# EAGLE schematic N_5412K (EAGLE 9.5.0)

## Sheet 1 of 2
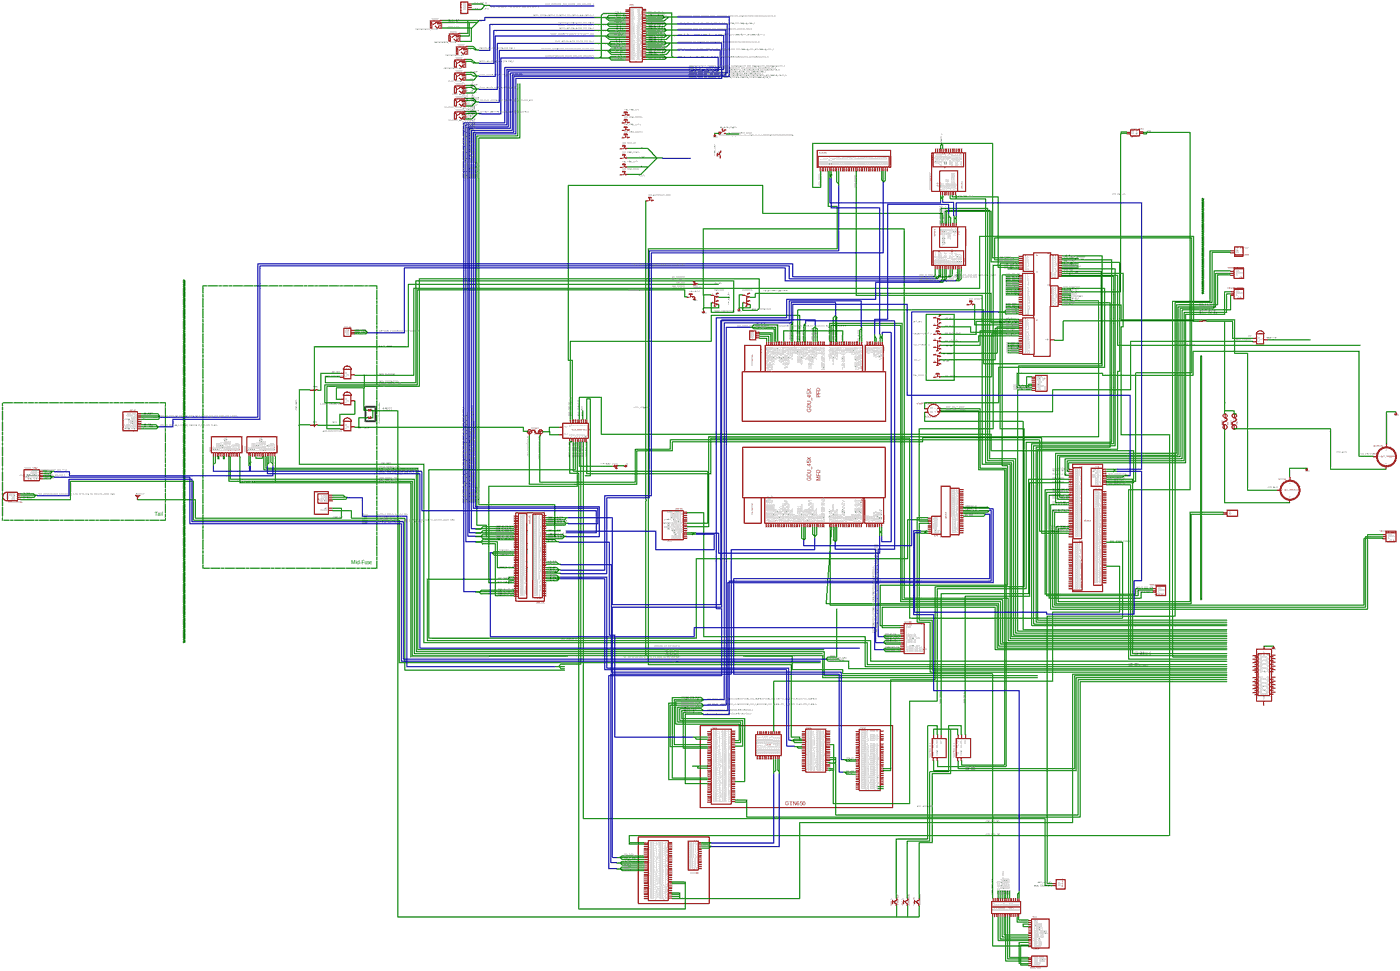
[diagram p0: schematic, sheet 1, overview]
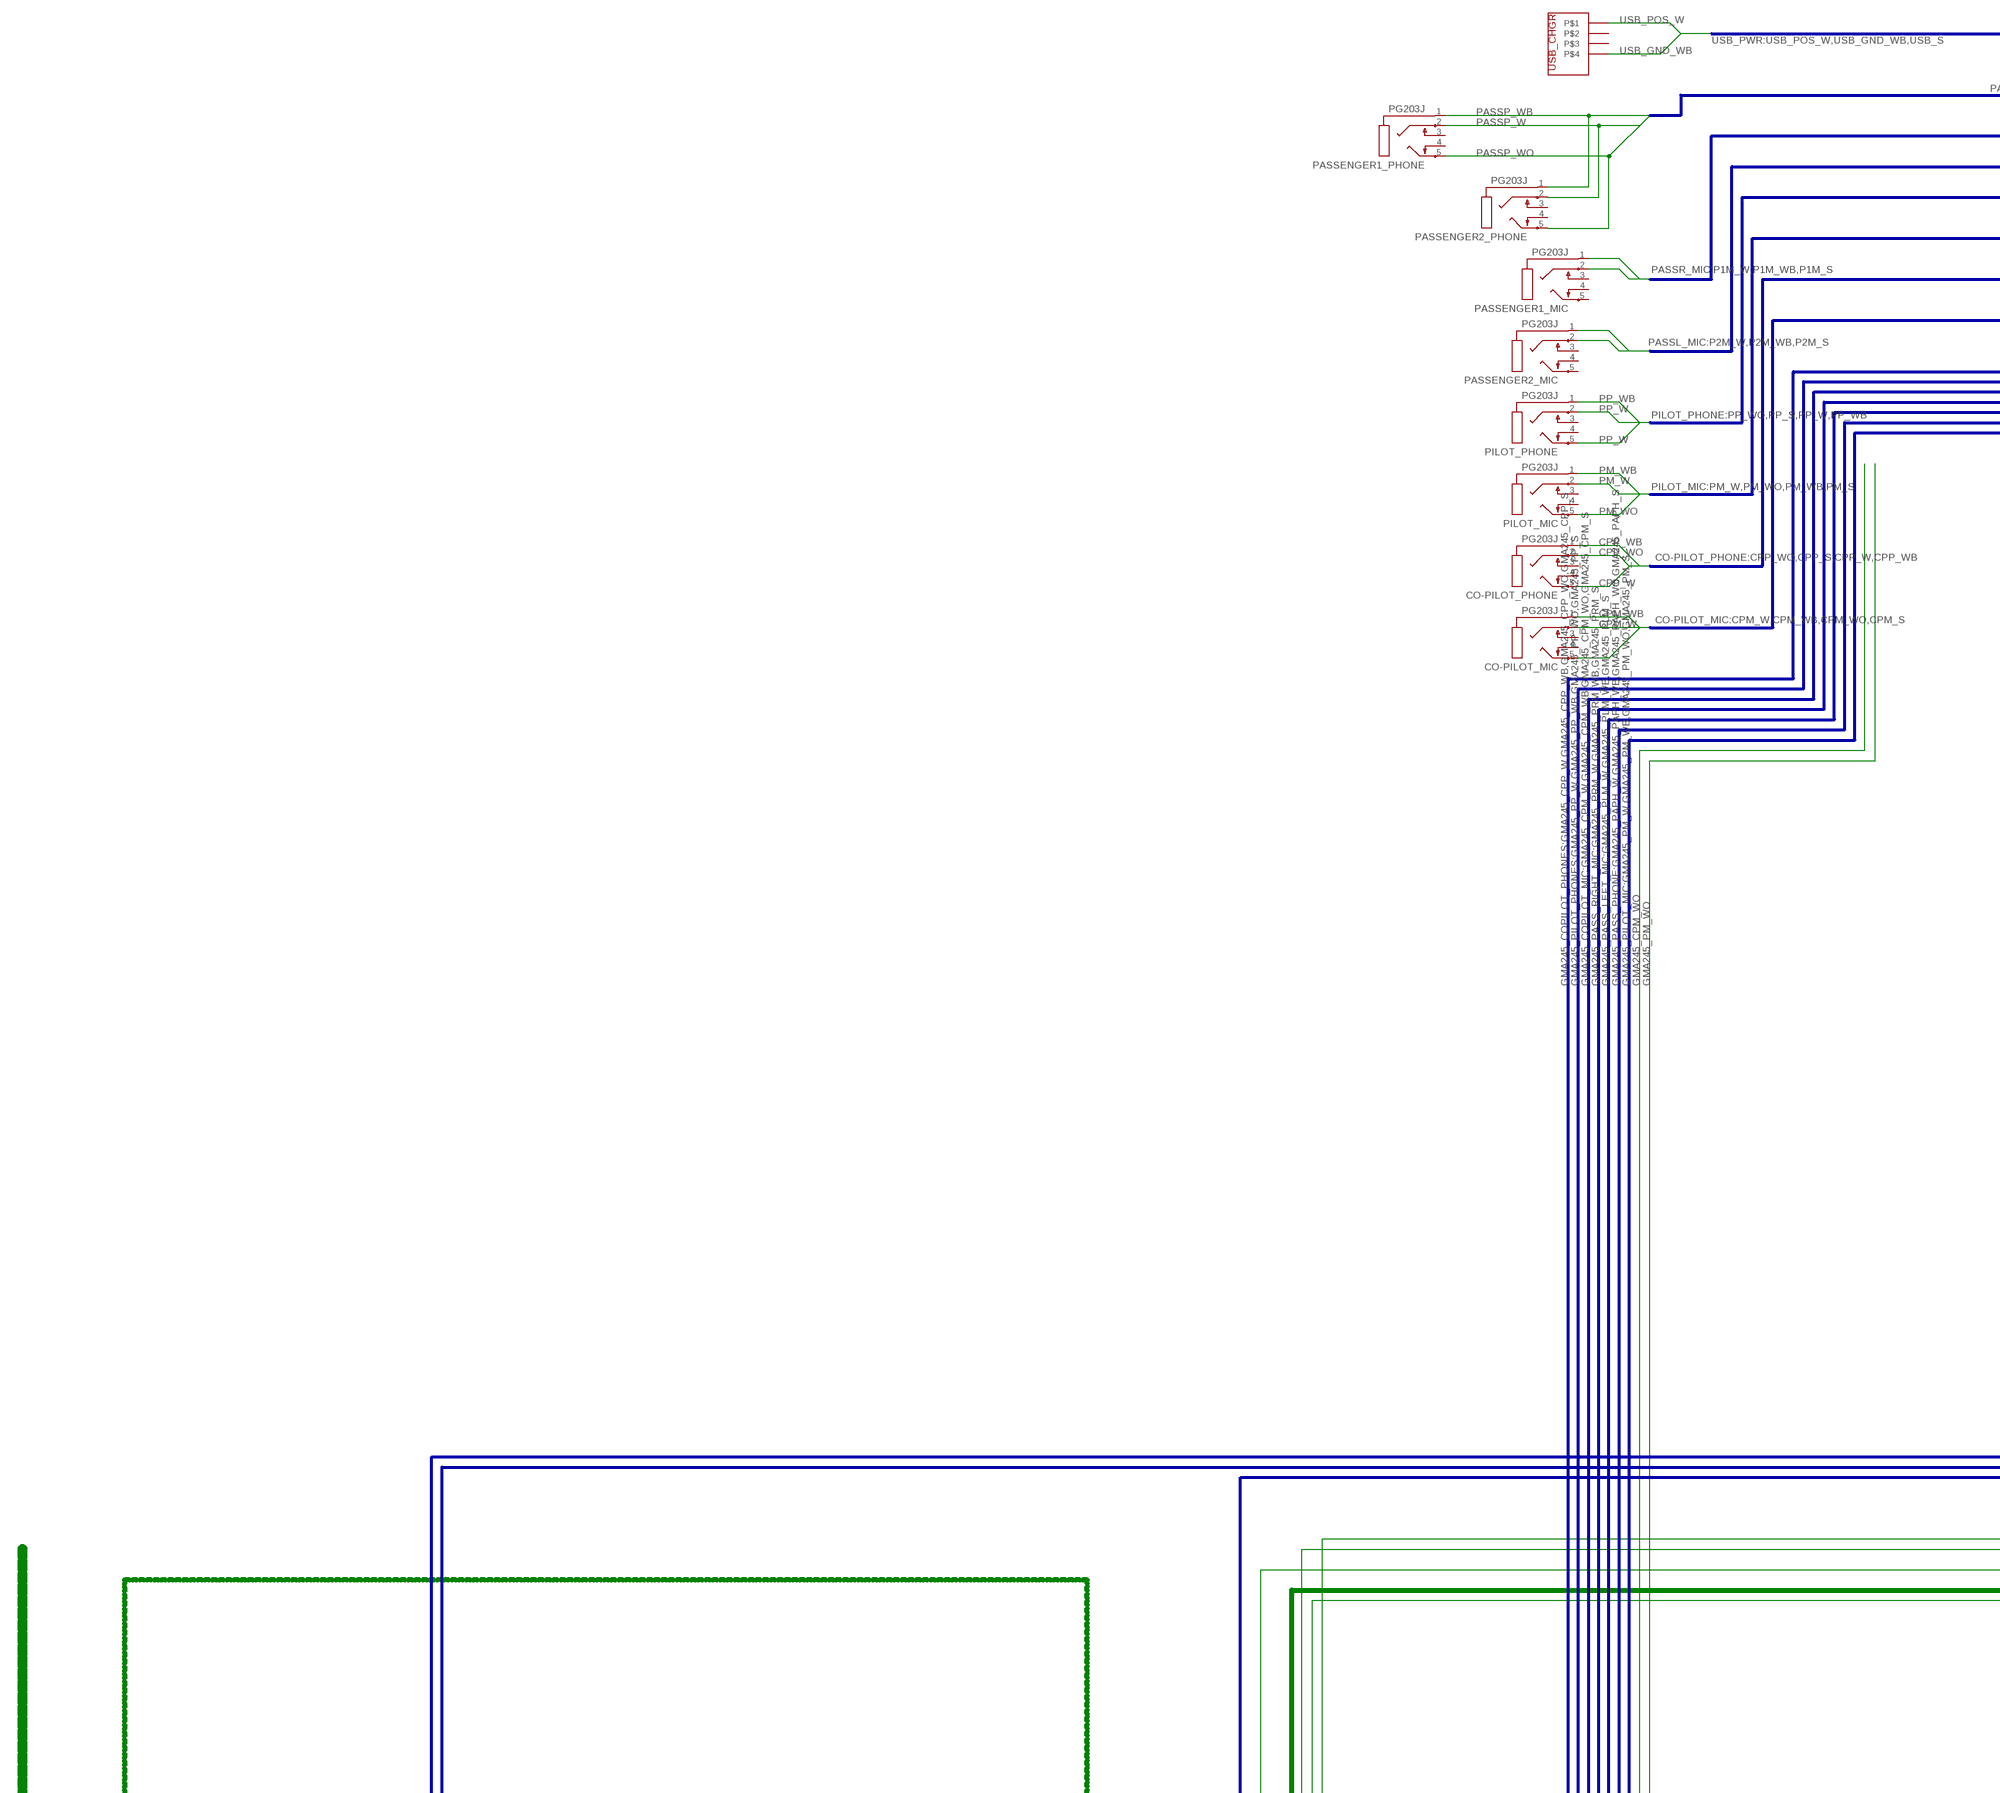
[diagram p1: schematic, sheet 1, part 1 of 9]
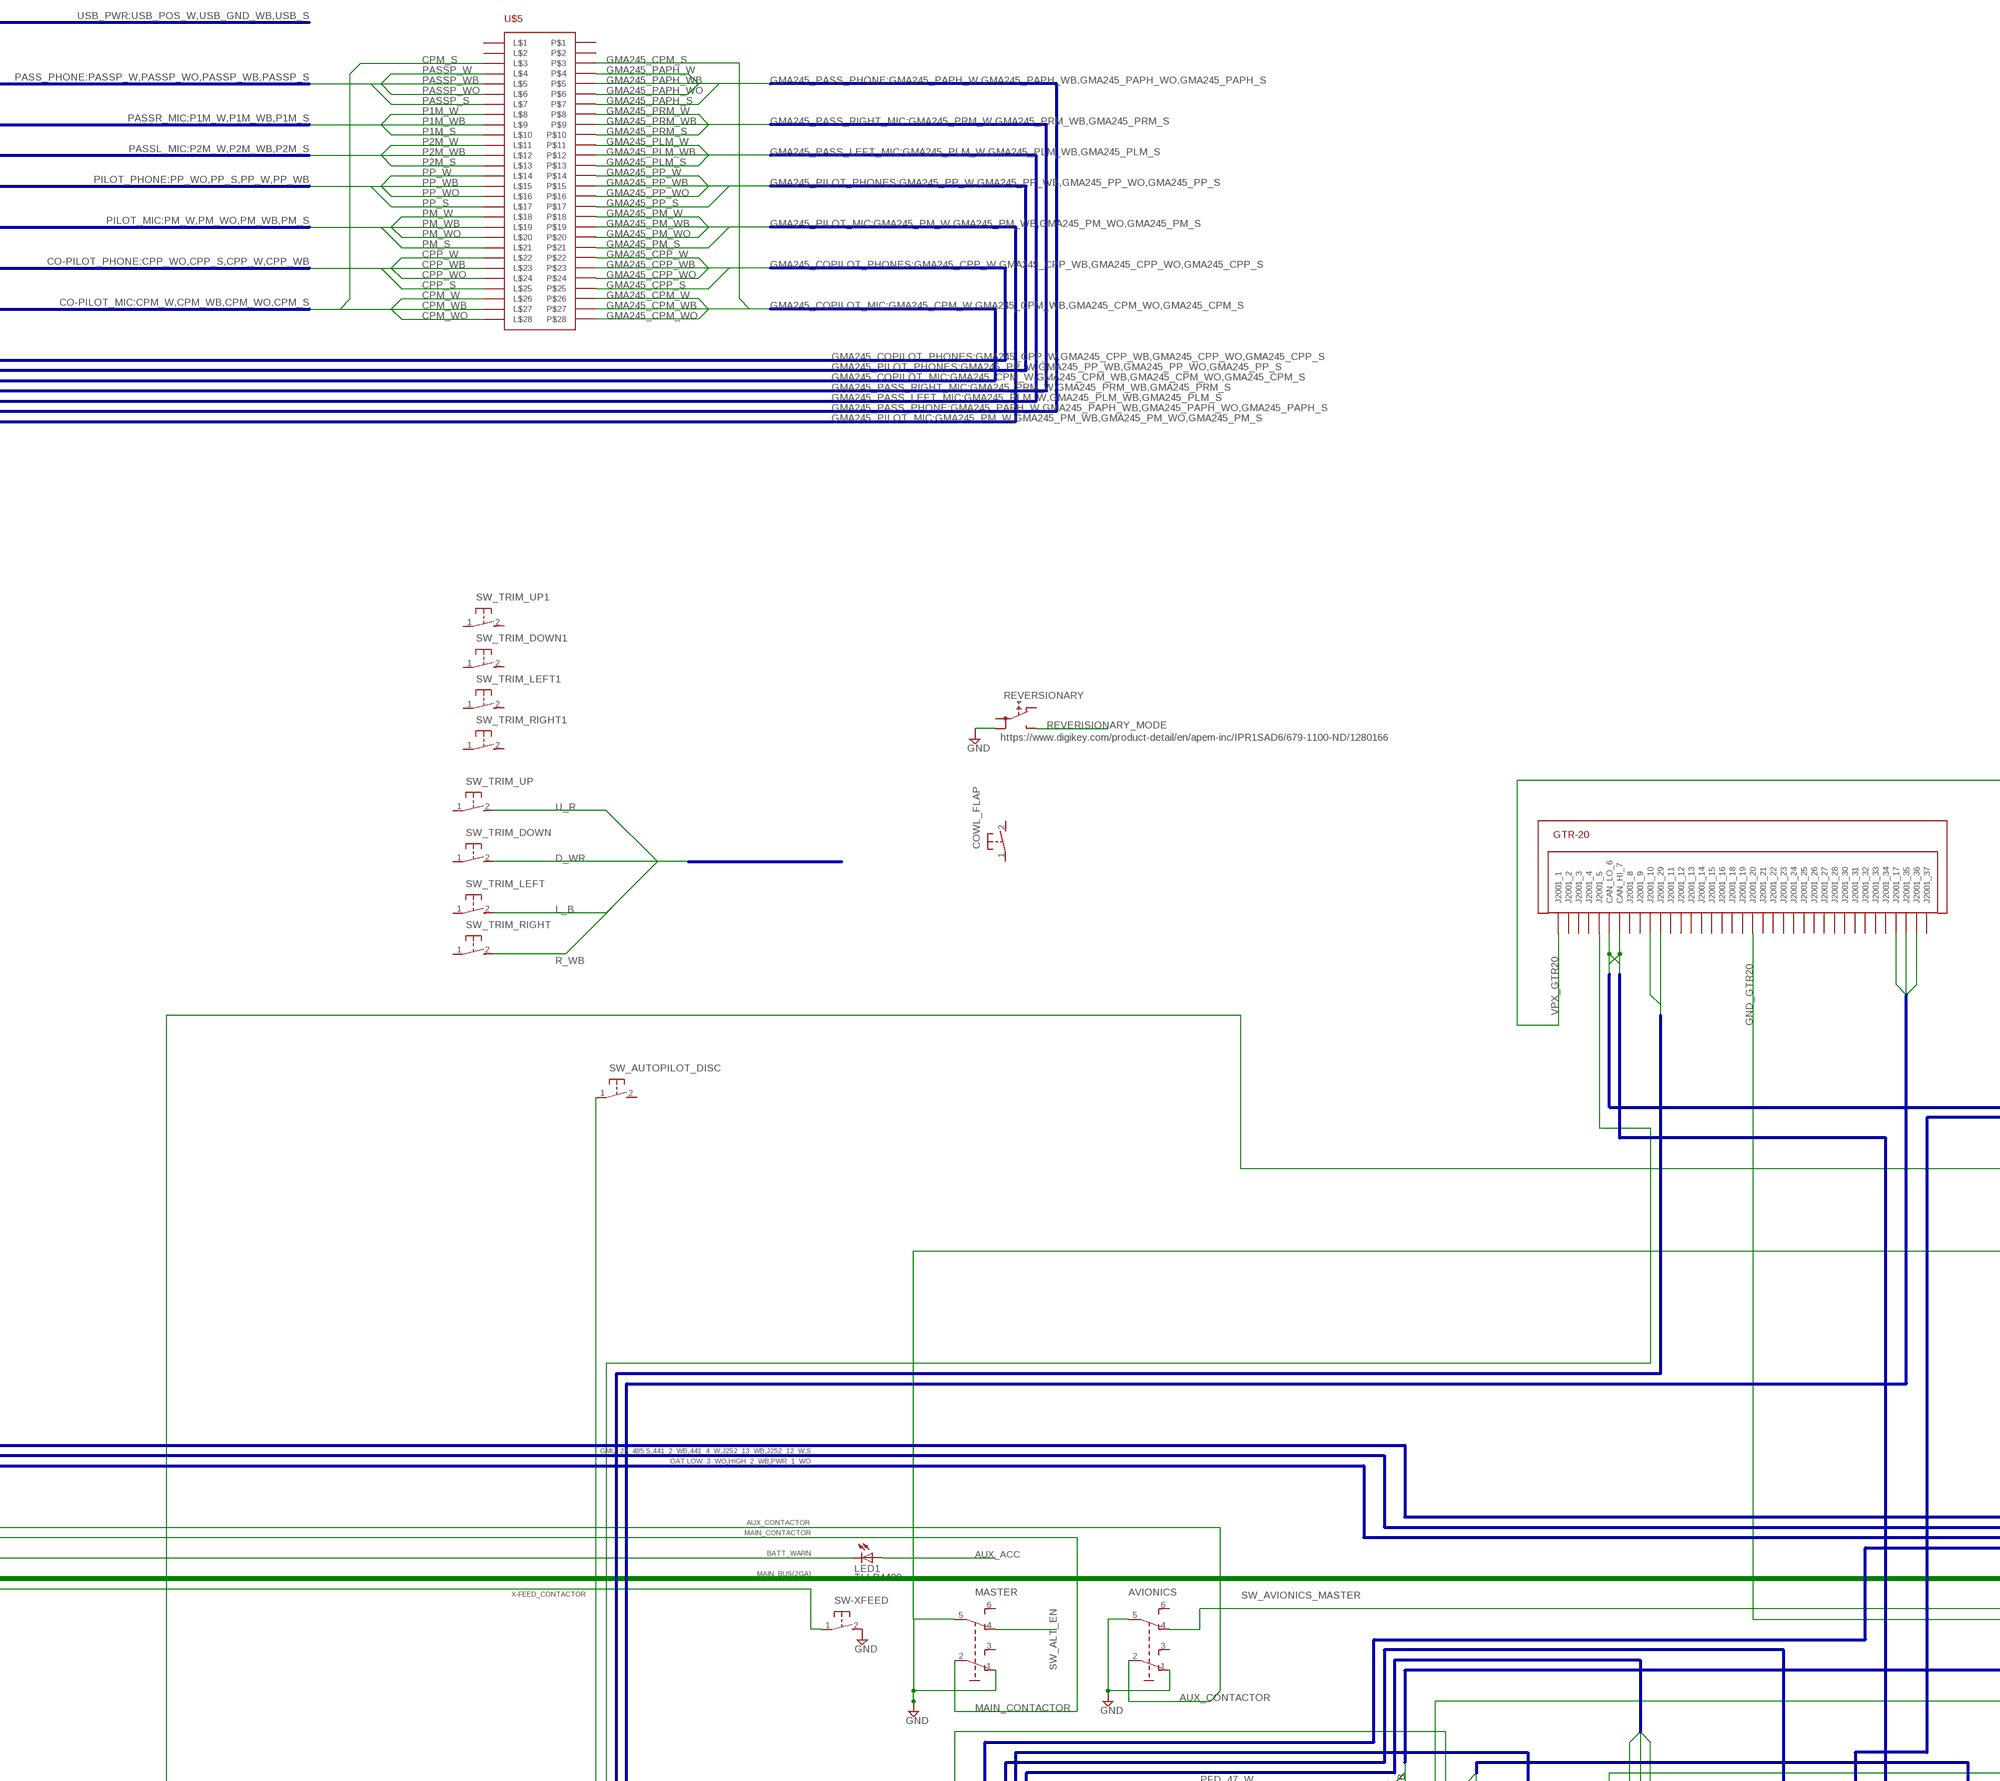
[diagram p2: schematic, sheet 1, part 2 of 9]
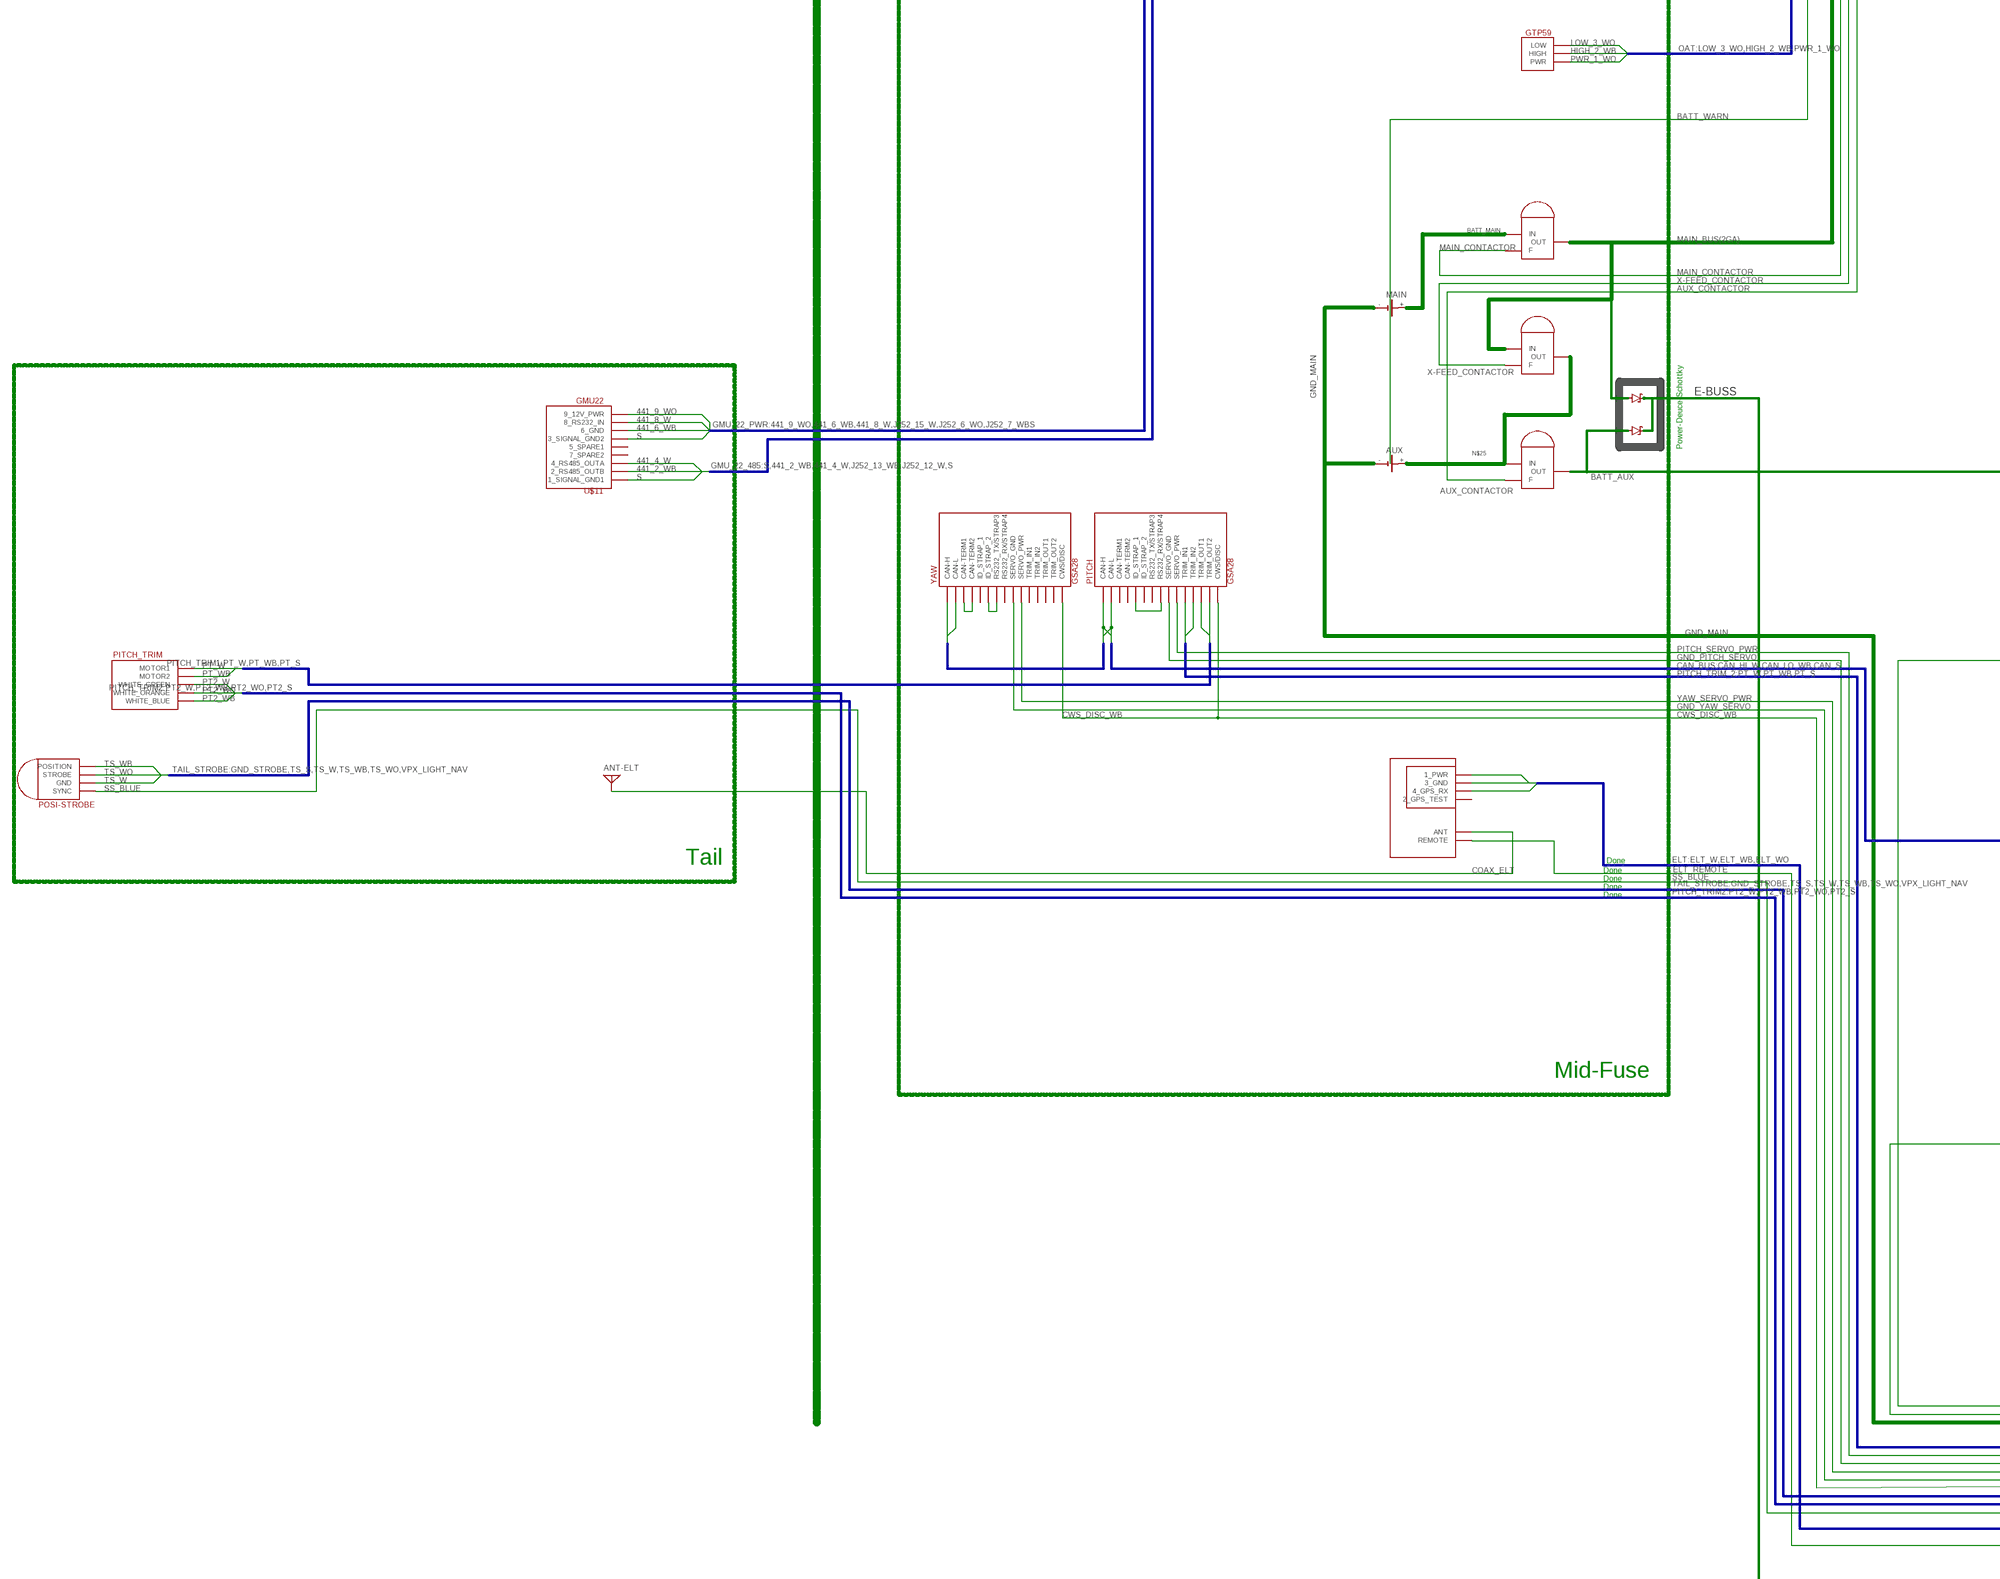
[diagram p3: schematic, sheet 1, part 3 of 9]
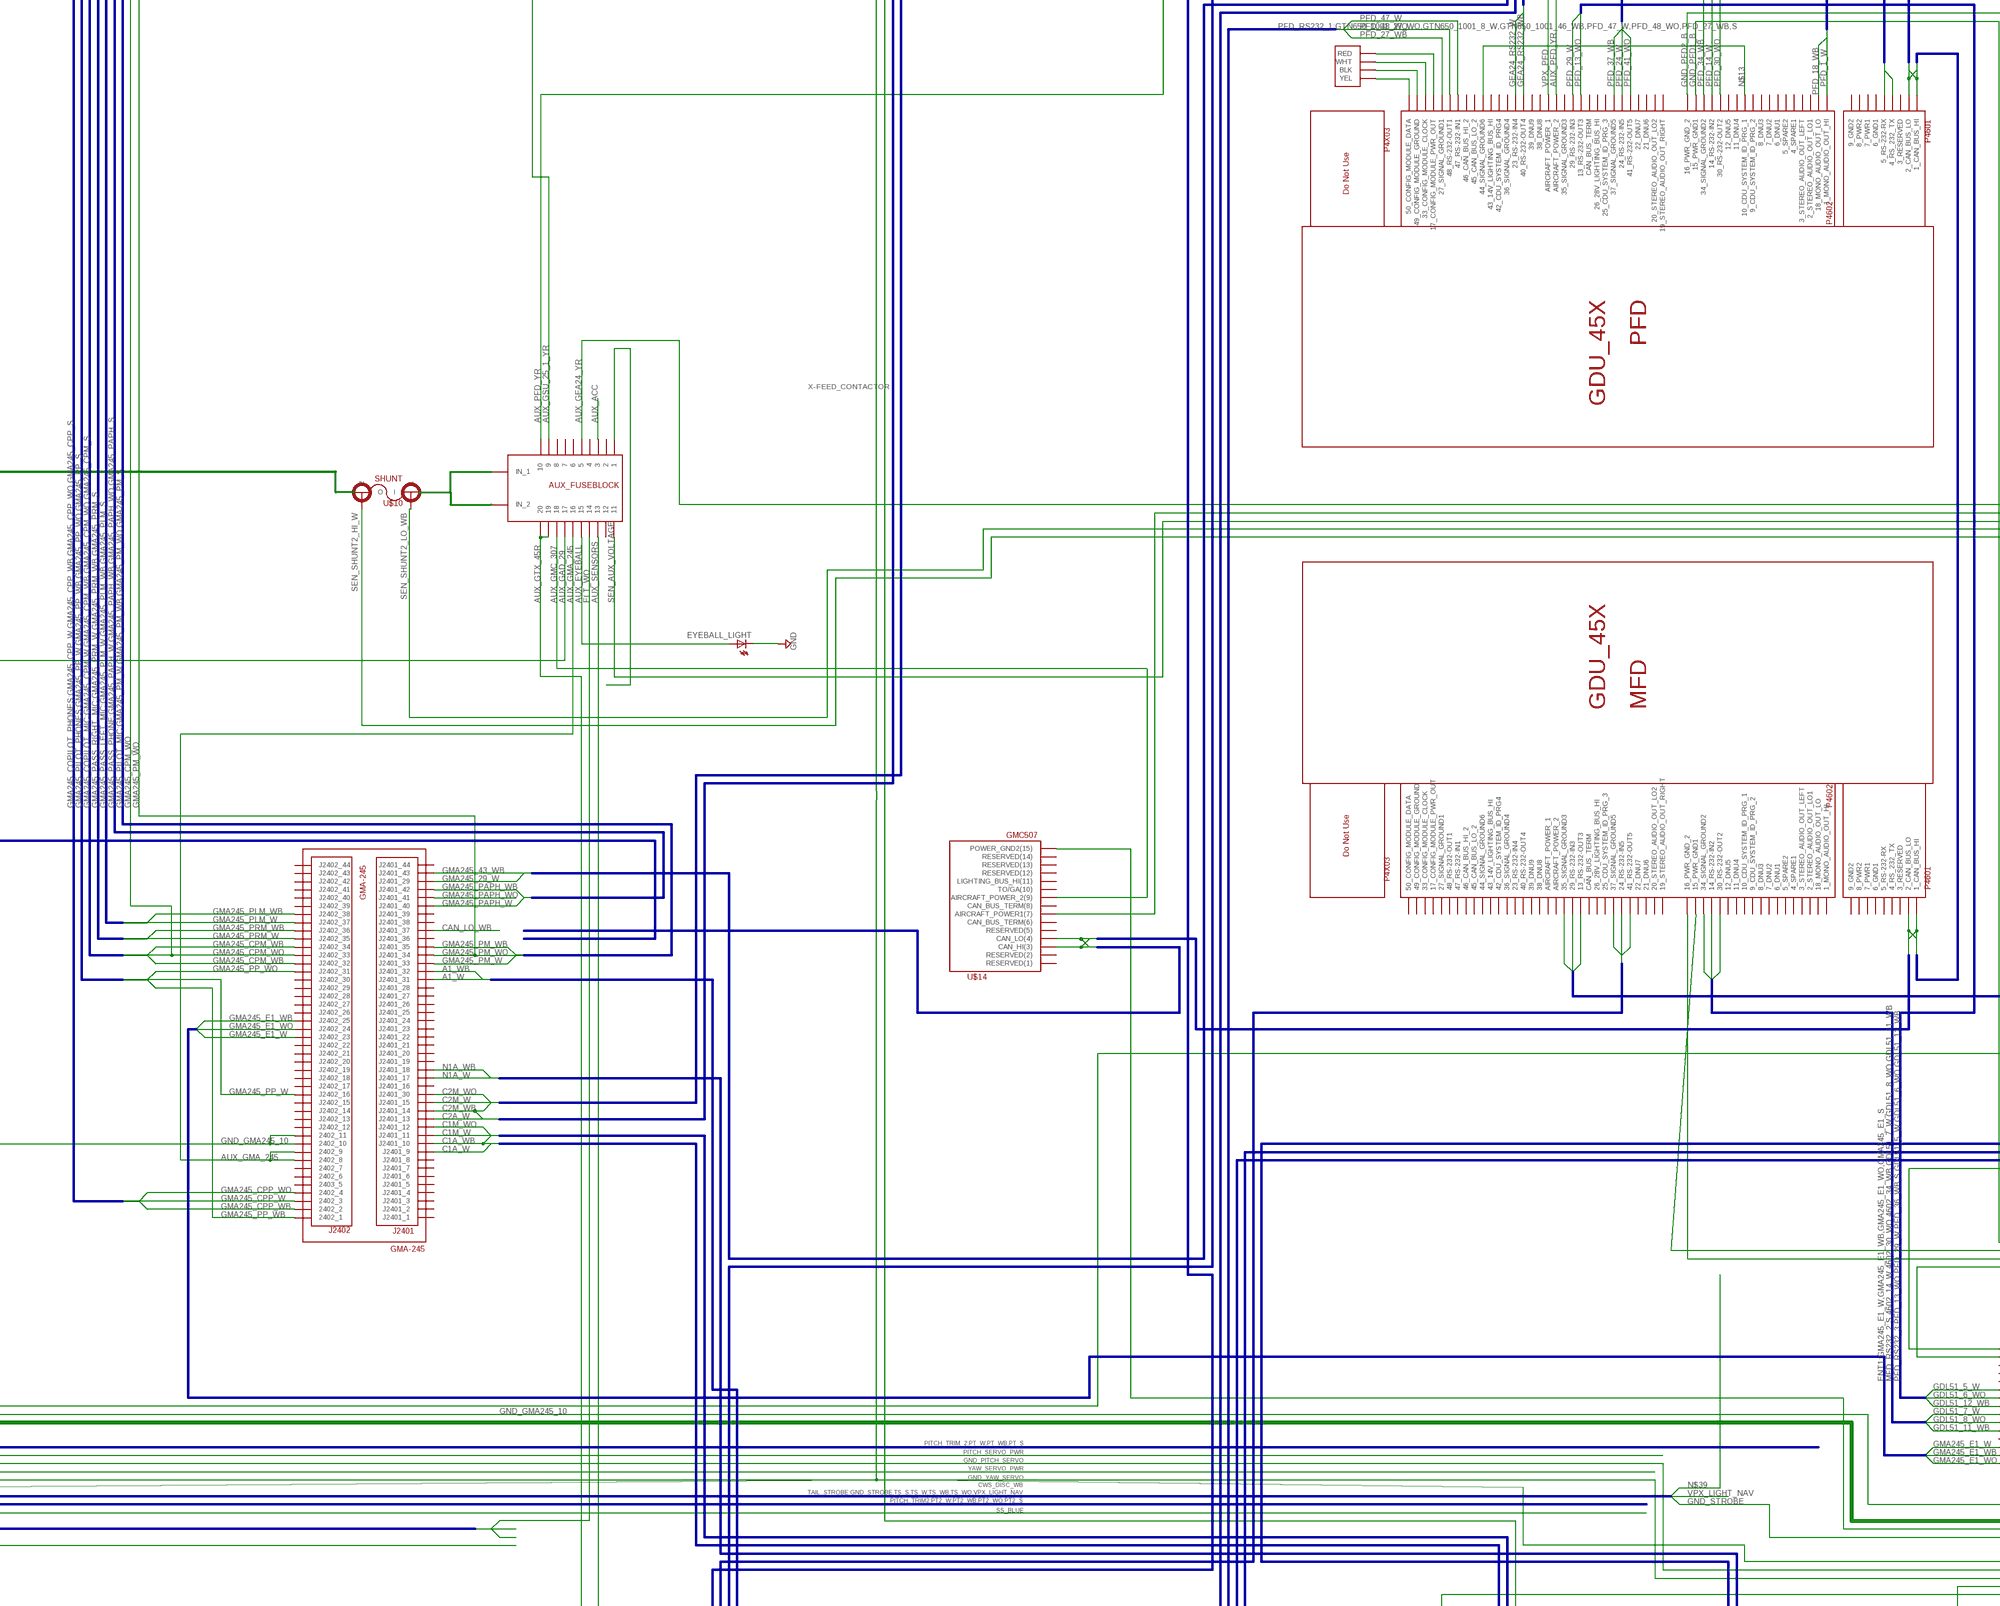
[diagram p4: schematic, sheet 1, part 4 of 9]
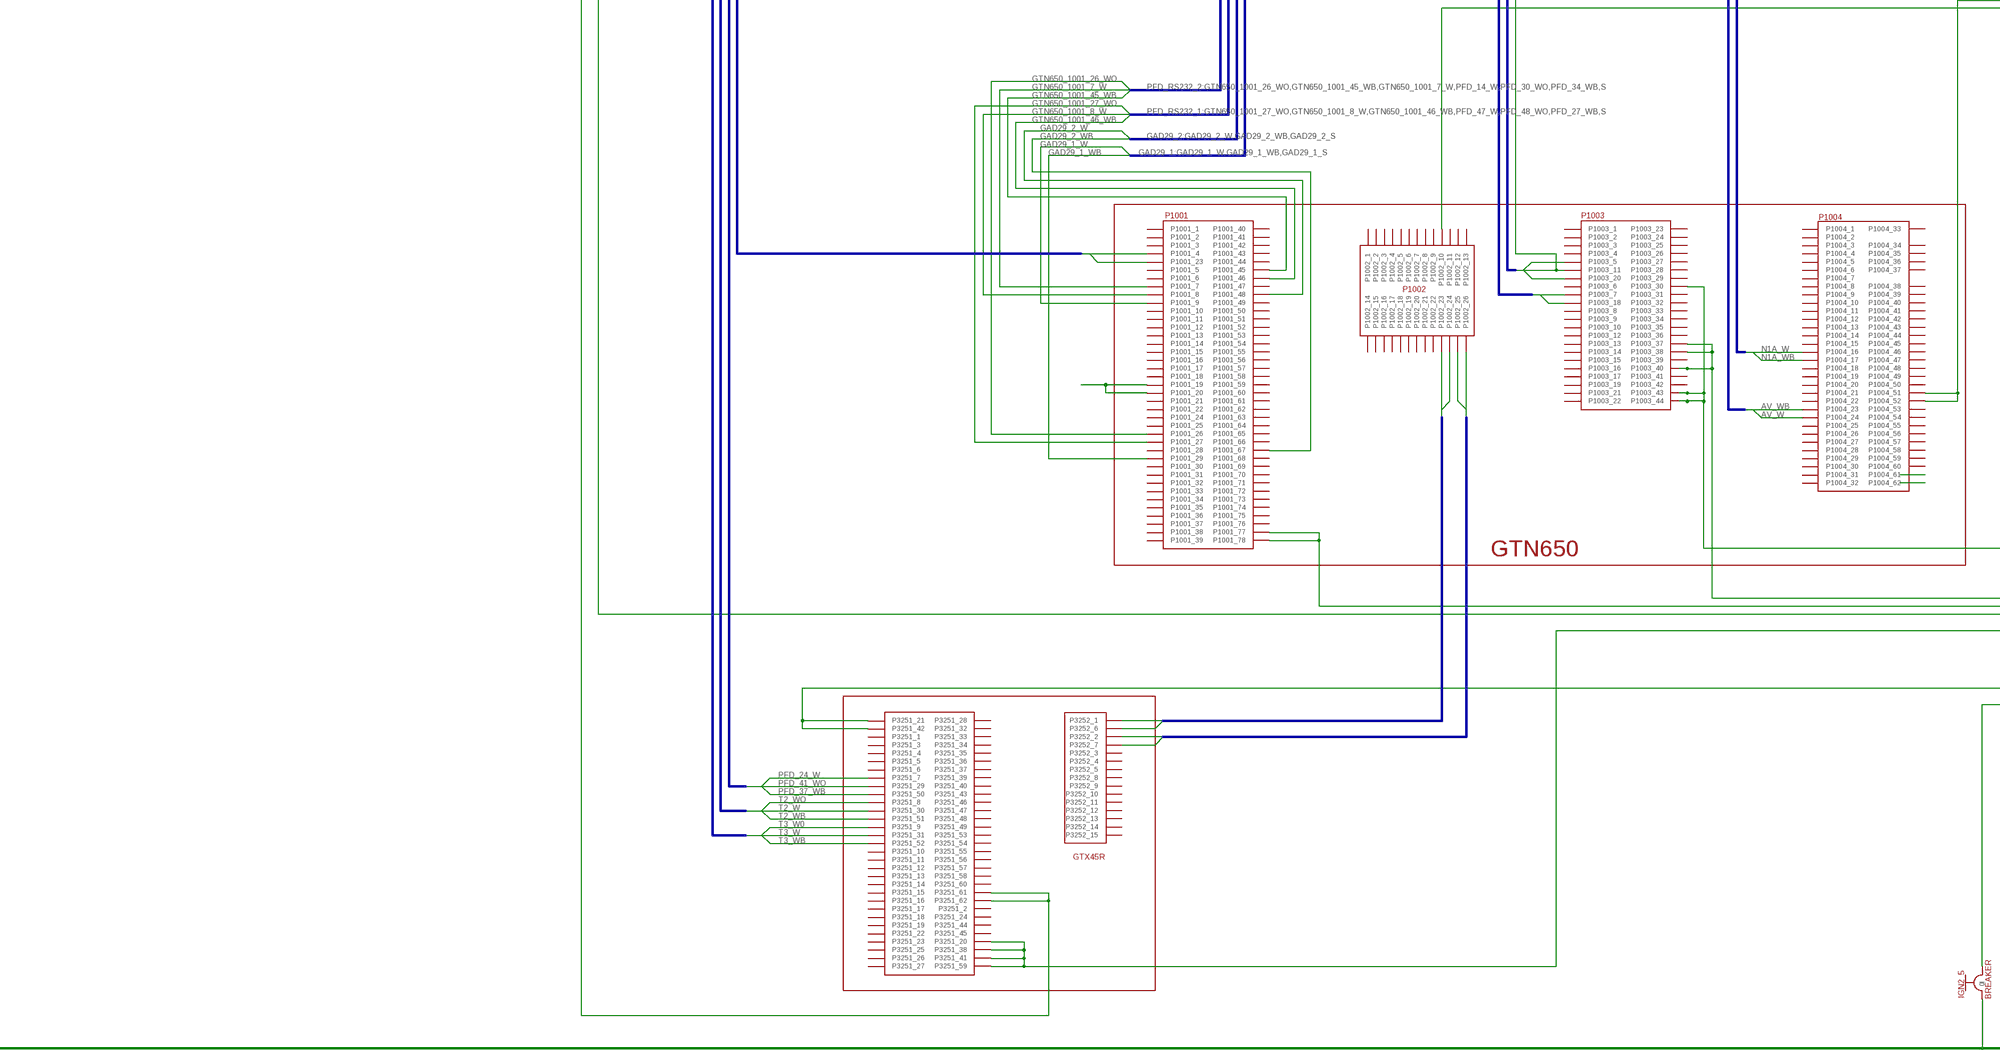
[diagram p5: schematic, sheet 1, part 5 of 9]
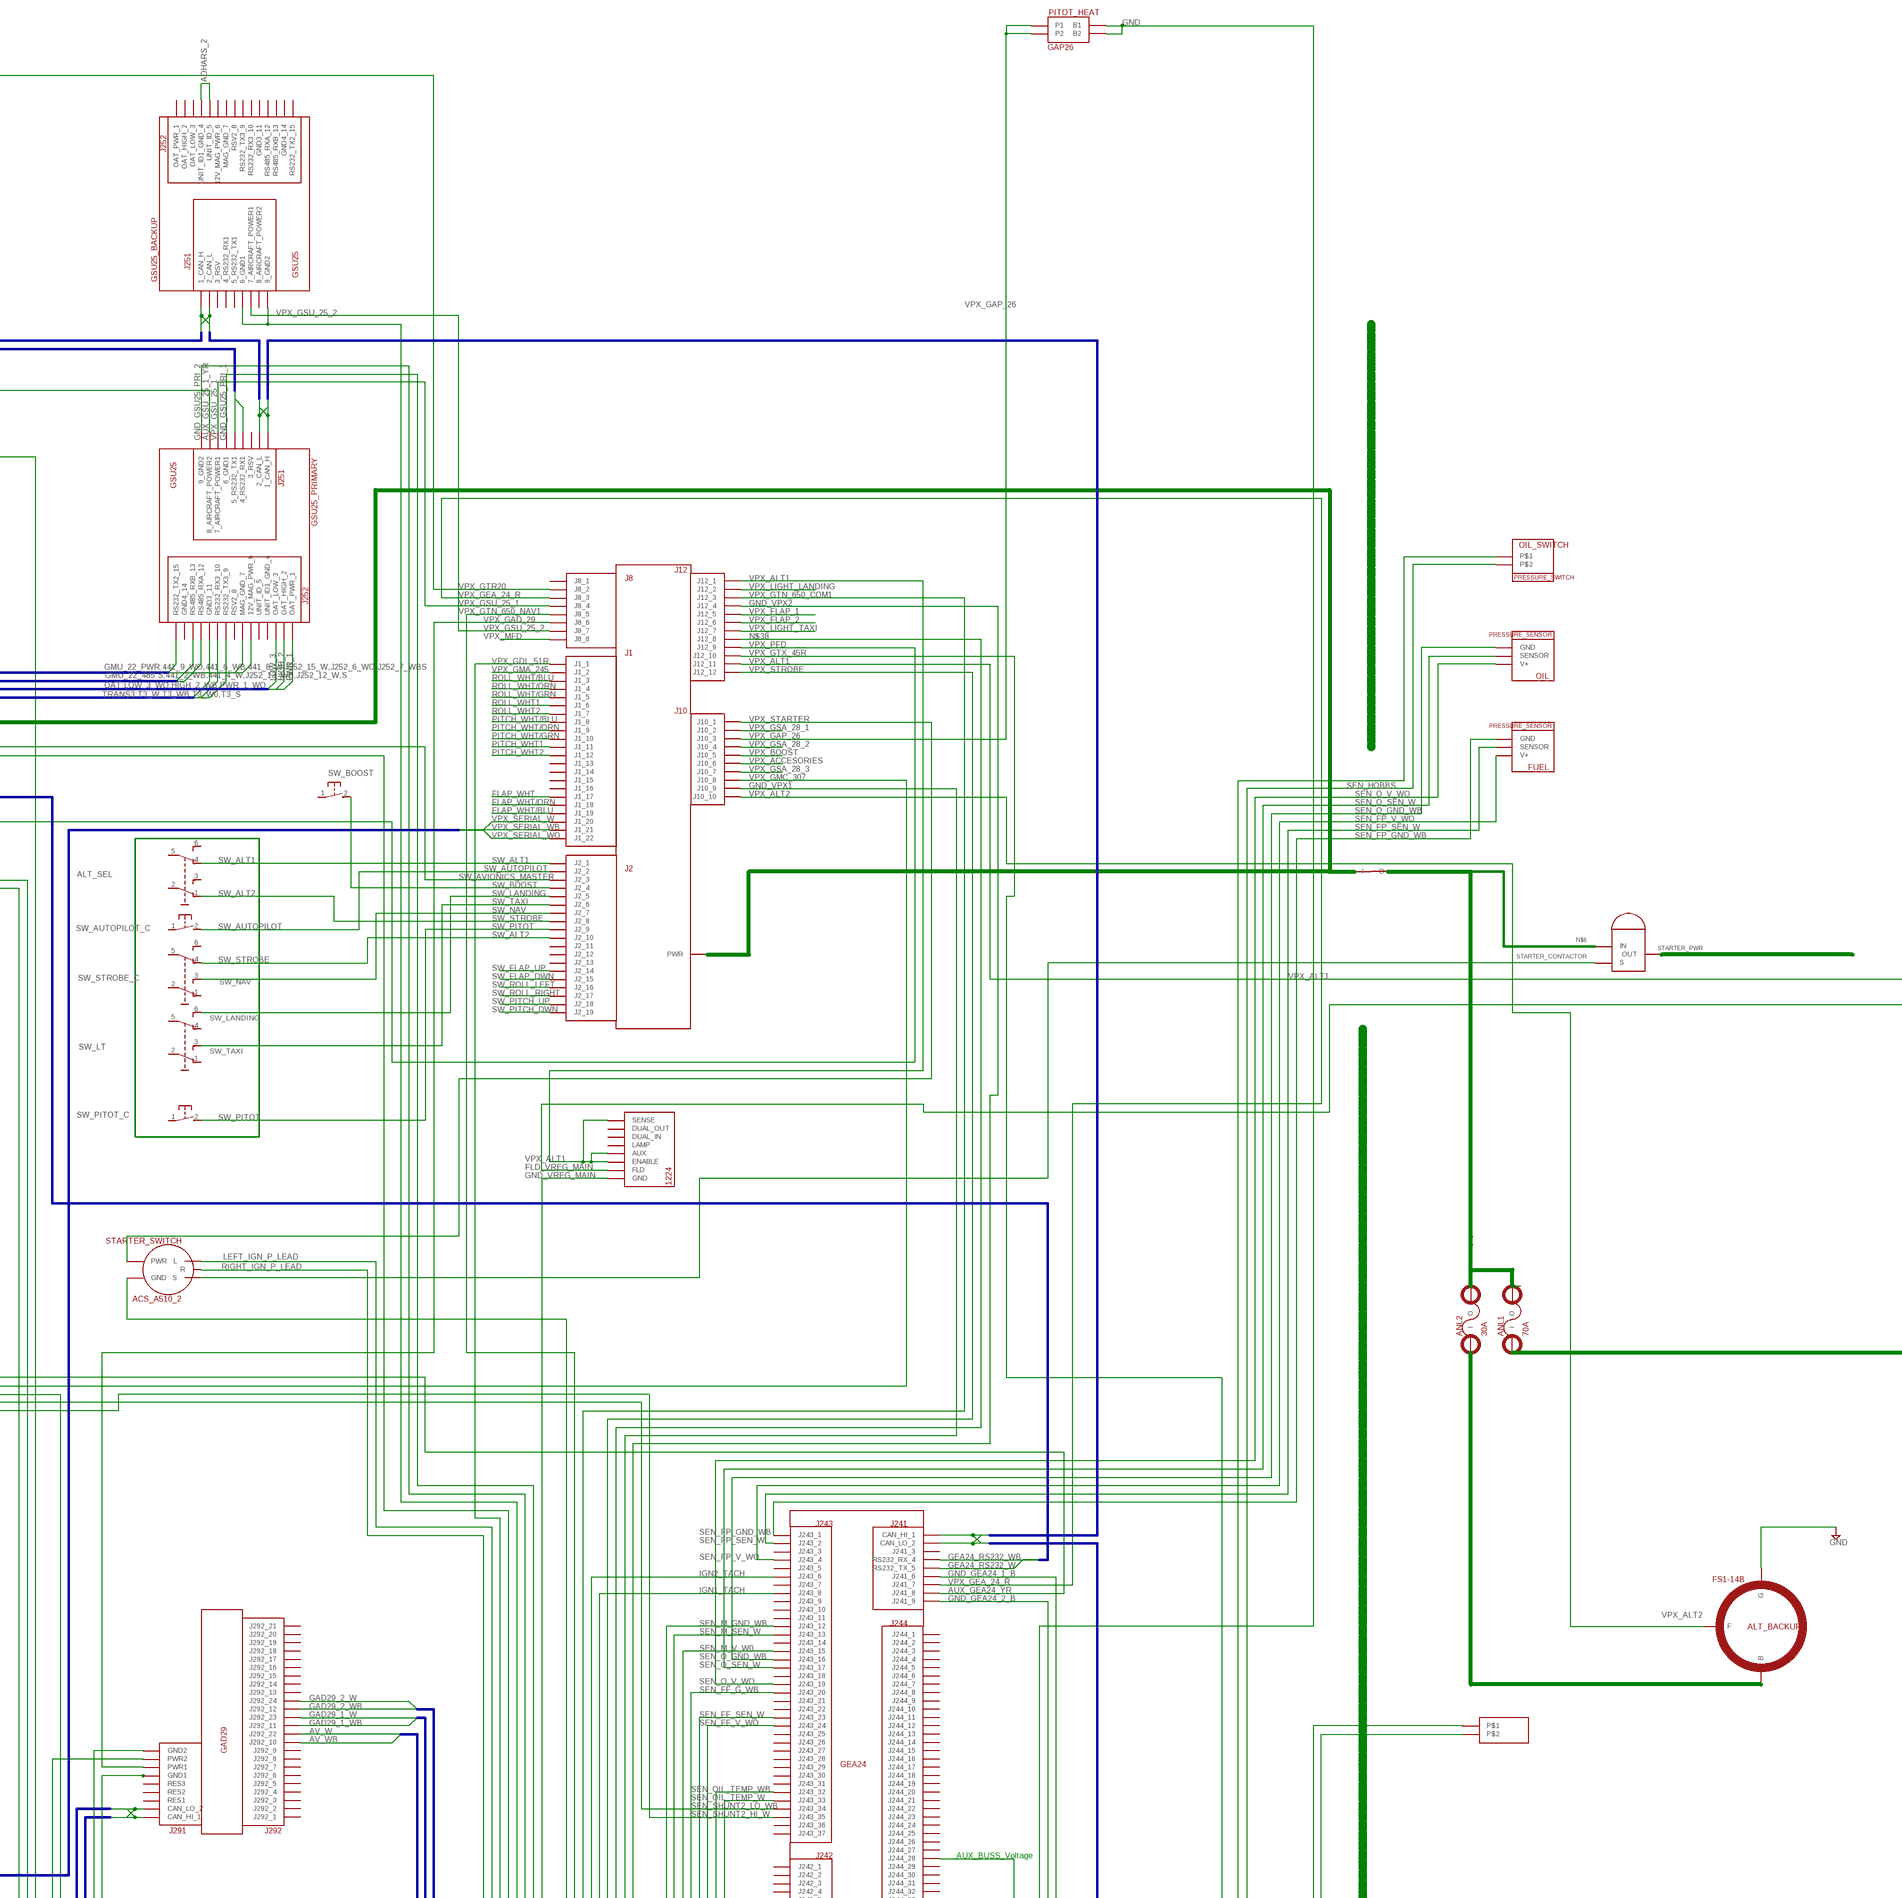
[diagram p6: schematic, sheet 1, part 6 of 9]
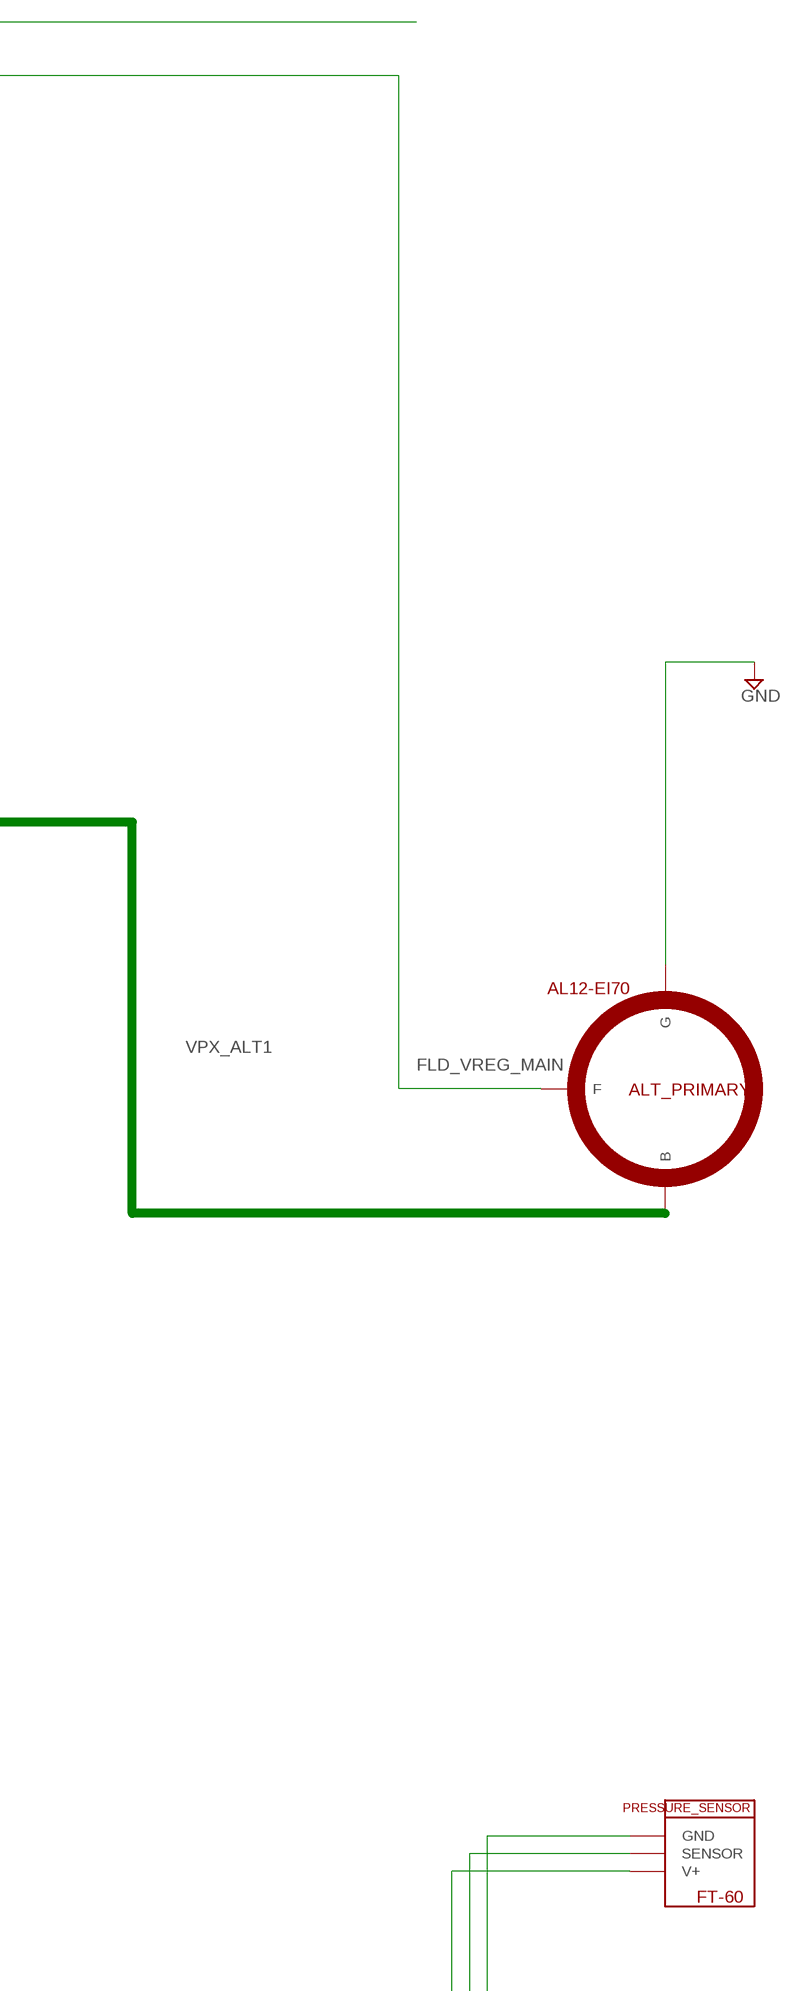
[diagram p7: schematic, sheet 1, part 7 of 9]
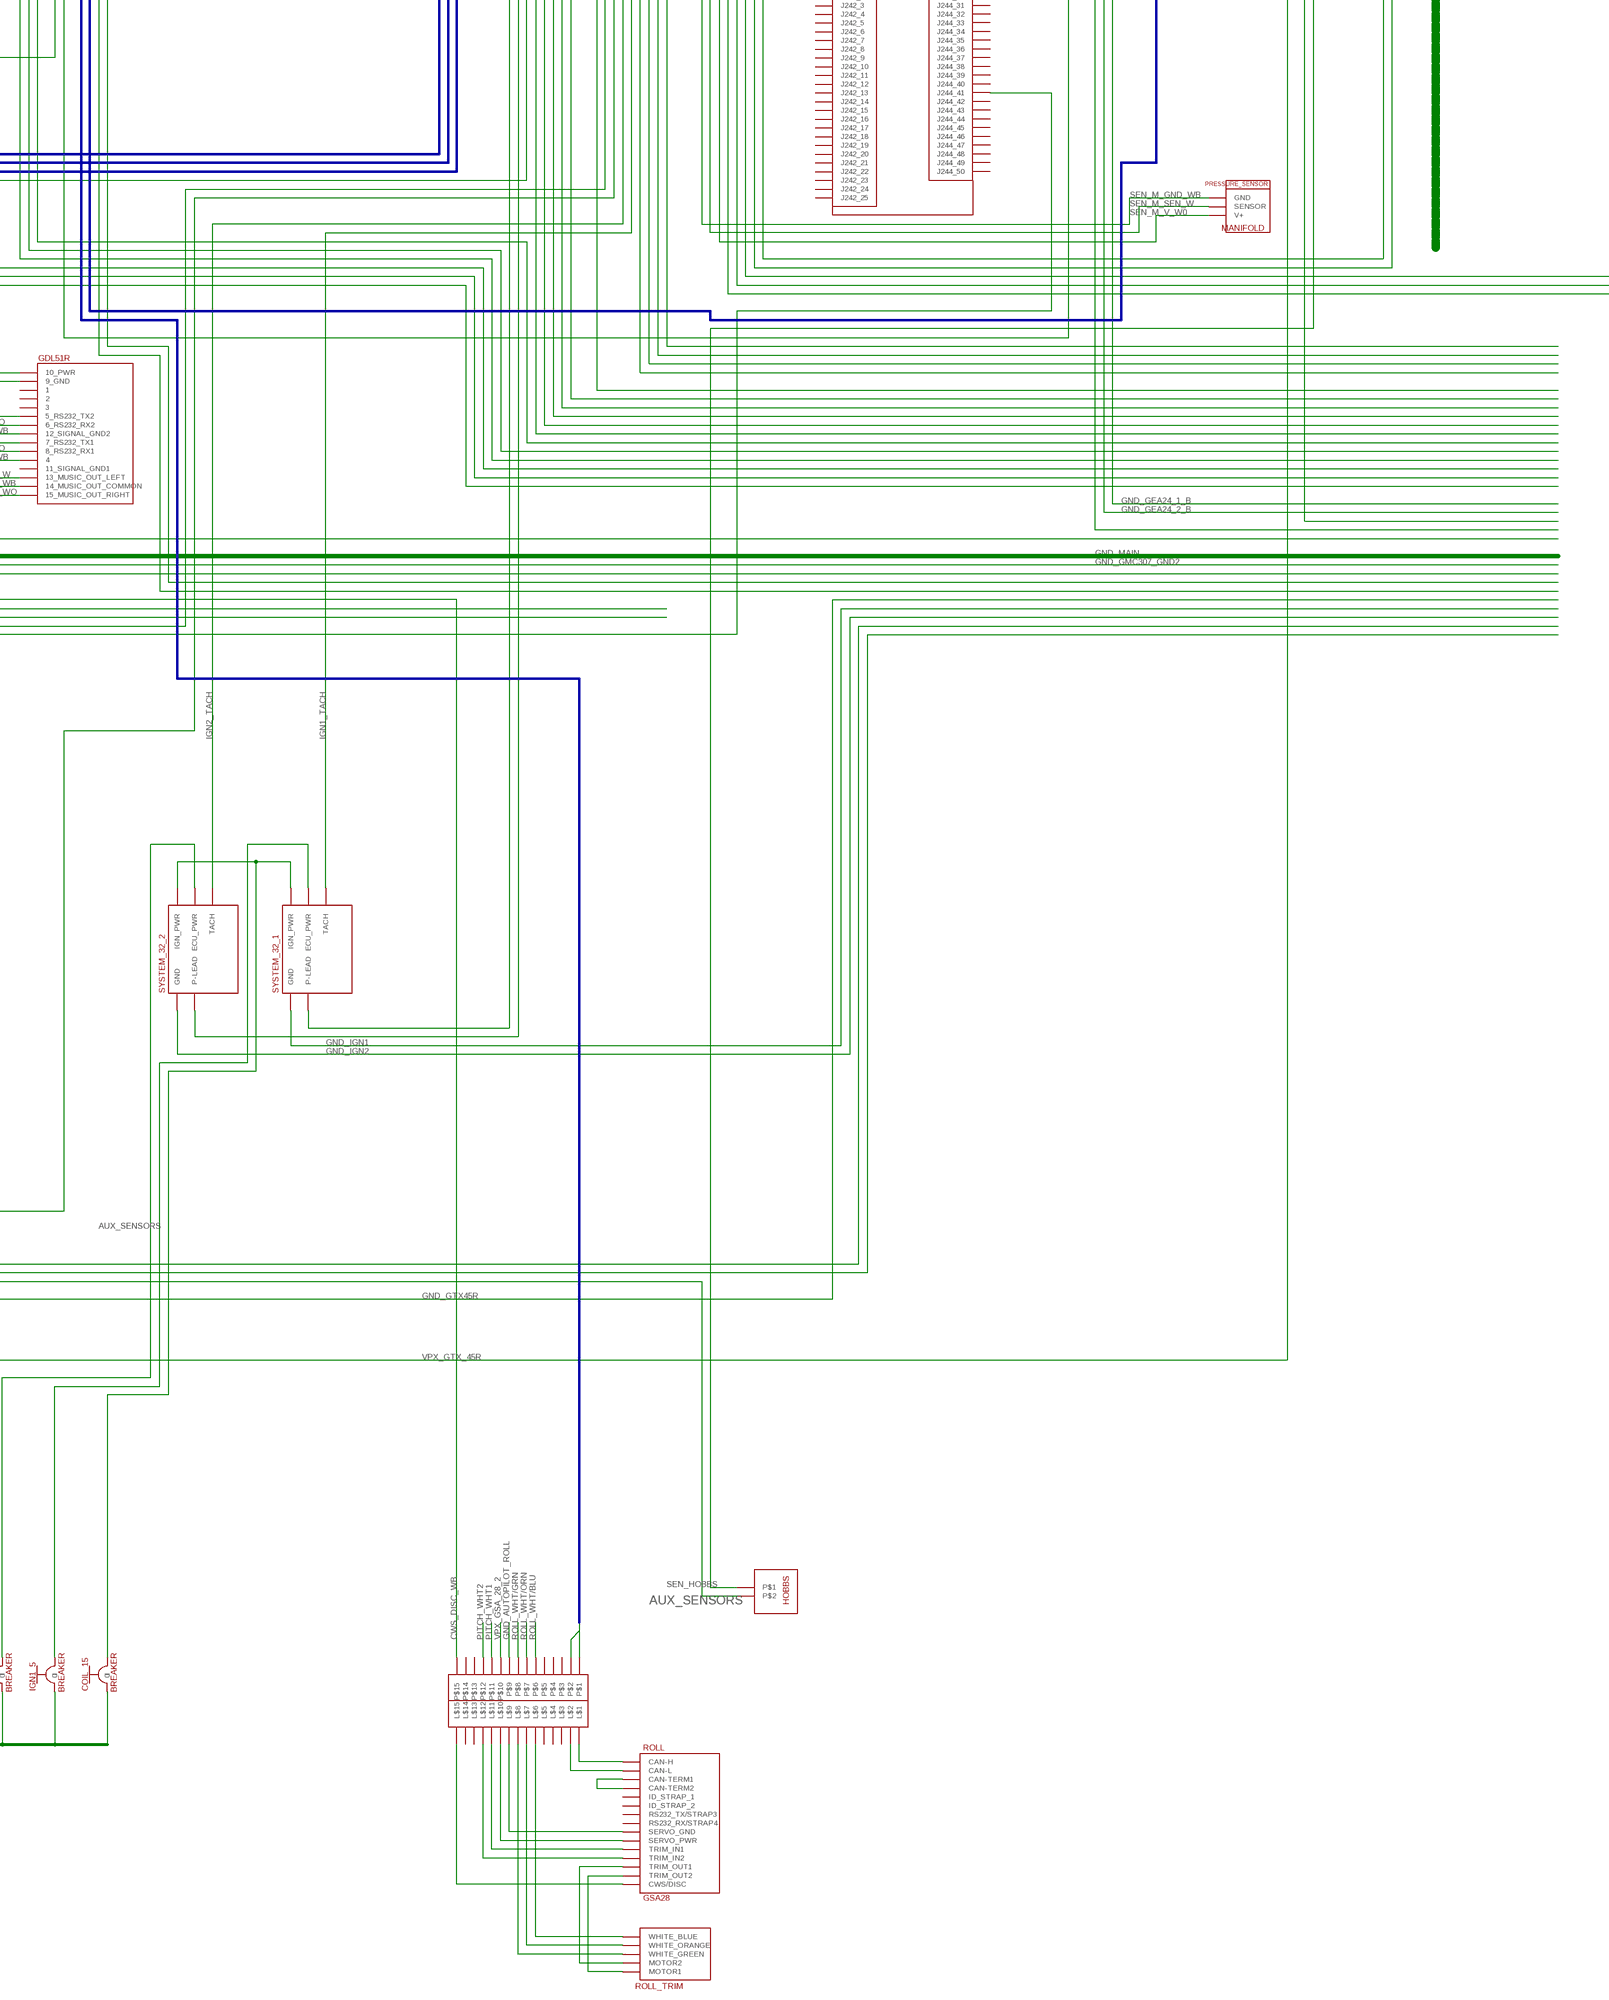
[diagram p8: schematic, sheet 1, part 8 of 9]
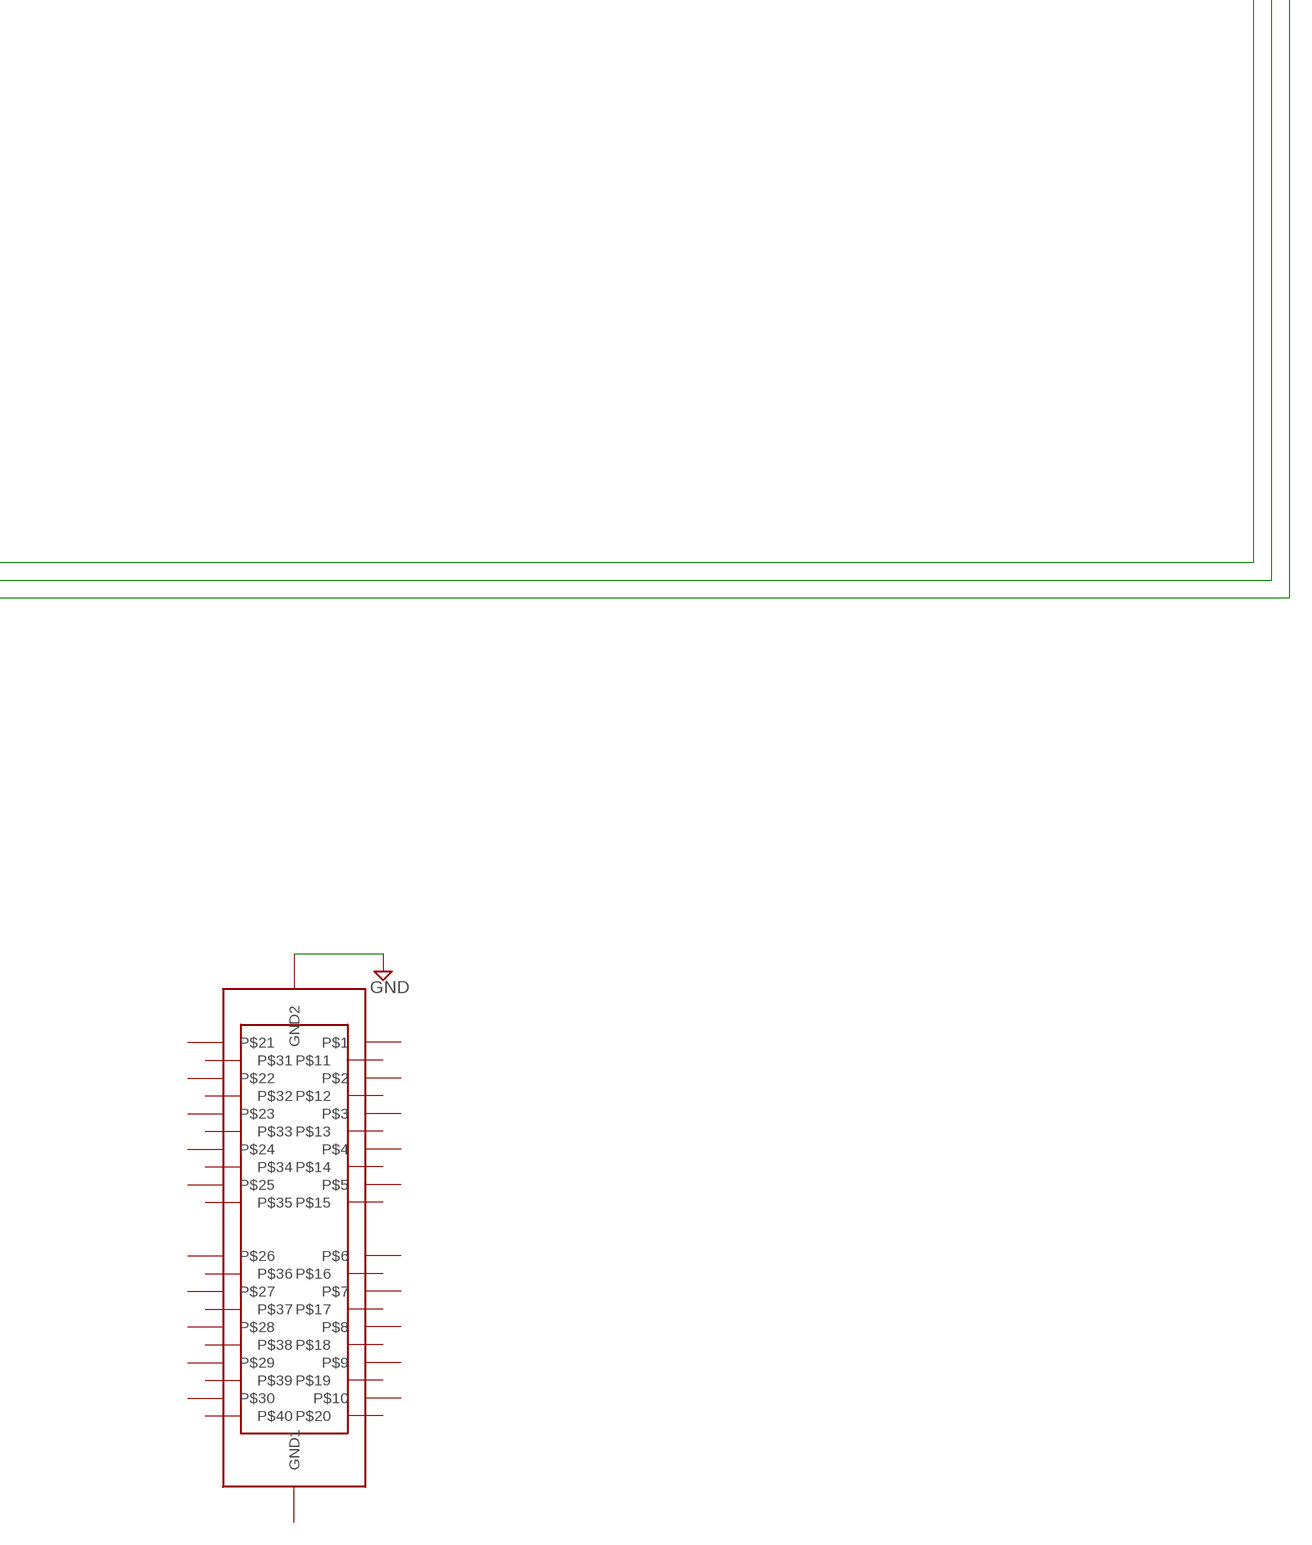
[diagram p9: schematic, sheet 1, part 9 of 9]

### Parts
1224  PLANEPWR_VREG  (no package)
ALT_BACKUP  FS1-14B  PLANE_POWER  (no package)
ALT_PRIMARY  AL12-EI70  PLANE_POWER  (no package)
ALT_SEL  TL46YO  [TL4XYO]
ANL1  70A  ANL  (no package)
ANL2  30A  ANL  (no package)
ANT-ELT  ANTENNA  [PAD-01]
AUX  SL-160AA/PR  [SL-160AA/PR]
AUX_FUSEBLOCK  11-13348  (no package)
AVIONICS  TL46YO  [TL4XYO]
CO-PILOT_MIC  PG203J  [PG203J]
CO-PILOT_PHONE  PG203J  [PG203J]
COIL_15  BREAKER  (no package)
COWL_FLAP  31-XX  [B3F-31XX]
D1  SCHOTTKY-DIODEAG  [AG]
D2  SCHOTTKY-DIODEAG  [AG]
EYEBALL_LIGHT  LEDIRL80A  [IRL80A]
FT-60  PRESSURE_SENSOR  (no package)
FUEL  PRESSURE_SENSOR  (no package)
GAD29  GAD29  (no package)
GDL51R  GDL51  (no package)
GEA24  GEA24  (no package)
GMA-245  GMA-245  (no package)
GSU25_BACKUP  GSU25  (no package)
GSU25_PRIMARY  GSU25  (no package)
GTN650  GTN_650  (no package)
GTP59  GTP59  (no package)
GTR-20  GTR20  (no package)
GTX45R  GTX45R  (no package)
IGN1_5  BREAKER  (no package)
IGN2_5  BREAKER  (no package)
LED1  TLLR4400  [LED3MM]
MAIN  SL-160AA/PR  [SL-160AA/PR]
MANIFOLD  PRESSURE_SENSOR  (no package)
MASTER  TL46YO  [TL4XYO]
MASTER_CONTACTOR  MASTER_CONTACTOR  (no package)
MASTER_CONTACTOR1  MASTER_CONTACTOR  (no package)
MASTER_CONTACTOR2  MASTER_CONTACTOR  (no package)
MFD  GDU_45X  (no package)
OIL  PRESSURE_SENSOR  (no package)
OIL_SWITCH  PRESSURE_SWITCH  (no package)
PASSENGER1_MIC  PG203J  [PG203J]
PASSENGER1_PHONE  PG203J  [PG203J]
PASSENGER2_MIC  PG203J  [PG203J]
PASSENGER2_PHONE  PG203J  [PG203J]
PFD  GDU_45X  (no package)
PILOT_MIC  PG203J  [PG203J]
PILOT_PHONE  PG203J  [PG203J]
PITCH  GSA28  (no package)
PITCH_TRIM  RAYALLEN_T2  (no package)
PITOT_HEAT  GAP26  (no package)
POSI-STROBE  POSISTROBE  (no package)
REVERSIONARY  https://www.digikey.com/product-detail/en/apem-inc/IPR1SAD6/679-1100-ND/1280166  5501  [5501]
ROLL  GSA28  (no package)
ROLL_TRIM  RAYALLEN_T2  (no package)
STARTER_SWITCH  ACS_A510_2  (no package)
SW-XFEED  31-XX  [B3F-31XX]
SW_AUTOPILOT_C  31-XX  [B3F-31XX]
SW_AUTOPILOT_DISC  31-XX  [B3F-31XX]
SW_BOOST  31-XX  [B3F-31XX]
SW_LT  TL46YO  [TL4XYO]
SW_PITOT_C  31-XX  [B3F-31XX]
SW_STROBE_C  TL46YO  [TL4XYO]
SW_TRIM_DOWN  31-XX  [B3F-31XX]
SW_TRIM_DOWN1  31-XX  [B3F-31XX]
SW_TRIM_LEFT  31-XX  [B3F-31XX]
SW_TRIM_LEFT1  31-XX  [B3F-31XX]
SW_TRIM_RIGHT  31-XX  [B3F-31XX]
SW_TRIM_RIGHT1  31-XX  [B3F-31XX]
SW_TRIM_UP  31-XX  [B3F-31XX]
SW_TRIM_UP1  31-XX  [B3F-31XX]
SYSTEM_32_1  SYSTEM_32  (no package)
SYSTEM_32_2  SYSTEM_32  (no package)
U$1  VPX_PRO  (no package)
U$2  STARTER_CONTACTOR  (no package)
U$3  HOBBS_METER  (no package)
U$4  G3X_CONFIG  (no package)
U$5  CPC_28  (no package)
U$6  BULKHEAD  (no package)
U$7  ACK_E04  (no package)
U$8  THERMOCOUPLE  (no package)
U$10  SHUNT  (no package)
U$11  GMU22  (no package)
U$12  FORREST_OF_TABS  (no package)
U$13  CPC_15  (no package)
U$14  GMC507  (no package)
USB_CHGR  WM16793-ND  (no package)
YAW  GSA28  (no package)

### Nets
441_2_WB: U$11.2_RS485_OUTB
441_4_W: U$11.4_RS485_OUTA
441_6_WB: U$11.6_GND
441_8_W: U$11.8_RS232_IN
441_9_WO: U$11.9_12V_PWR
4601_4_W: PFD.4_RS_232_TX
4601_5_WB: PFD.5_RS-232-RX
4602_14_W: MFD.14_RS-232-IN2
4602_30_WO: MFD.30_RS-232-OUT2
4602_34_WB: MFD.34_SIGNAL_GROUND2
A1_W: GMA-245.J2401_31 GTN650.P1001_4
A1_WB: GMA-245.J2401_32 GTN650.P1001_23
ADHARS_2: GSU25_BACKUP.UNIT_ID1_GND_4 GSU25_BACKUP.UNIT_ID_5
AUX_ACC: AUX_FUSEBLOCK.3 LED1.A
AUX_CONTACTOR [Switches]: AVIONICS.2(P) MASTER_CONTACTOR1.F
AUX_EYEBALL [PWR_MASTER]: AUX_FUSEBLOCK.15 EYEBALL_LIGHT.A
AUX_GAD_29: AUX_FUSEBLOCK.17 GAD29.PWR2
AUX_GEA24_YR: AUX_FUSEBLOCK.5 GEA24.J241_8
AUX_GMA_245: AUX_FUSEBLOCK.16 GMA-245.2402_8 GMA-245.2402_9
AUX_GMC_307: AUX_FUSEBLOCK.18 U$14.AIRCRAFT_POWER_2(9)
AUX_GSU_25_1_YR: AUX_FUSEBLOCK.9 GSU25_PRIMARY.8_AIRCRAFT_POWER2
AUX_GTX_45R: AUX_FUSEBLOCK.19 AUX_FUSEBLOCK.20 GTX45R.P3251_61 GTX45R.P3251_62
AUX_PFD_YR [PWR_MASTER]: AUX_FUSEBLOCK.10 PFD.AIRCRAFT_POWER_2
AUX_SENSORS: AUX_FUSEBLOCK.13 U$3.P$2
AV_W: GAD29.J292_22 GTN650.P1004_24
AV_WB: GAD29.J292_10 GTN650.P1004_23
BATT_AUX: D2.A MASTER_CONTACTOR1.OUT U$10.O
BATT_MAIN: MAIN.+ MASTER_CONTACTOR.IN
BATT_WARN: LED1.K(C)
C1A_W: GMA-245.J2401_9 GTN650.P1003_7
C1A_WB: GMA-245.J2401_10 GTN650.P1003_18
C1M_W: GMA-245.J2401_11 GTN650.P1003_5
C1M_WB: GTN650.P1003_20
C1M_WO: GMA-245.J2401_12 GTN650.P1003_11 GTR-20.J2001_5
C2A_W: GMA-245.J2401_13 GTR-20.J2001_29
C2A_WB: GTR-20.J2001_10
C2M_W: GMA-245.J2401_15 GTR-20.J2001_17
C2M_WB: GMA-245.J2401_14 GTR-20.J2001_36
C2M_WO: GMA-245.J2401_30 GTR-20.J2001_35
CAN_HI_W: GAD29.CAN_HI_1 GEA24.CAN_HI_1 GSU25_BACKUP.1_CAN_H GSU25_PRIMARY.1_CAN_H GTR-20.CAN_HI_7 MFD.1_CAN_BUS_HI PFD.1_CAN_BUS_HI PITCH.CAN-H U$13.P$1 U$14.CAN_HI(3) YAW.CAN-H
CAN_LO_WB: GAD29.CAN_LO_2 GEA24.CAN_LO_2 GMA-245.J2401_37 GSU25_BACKUP.2_CAN_L GSU25_PRIMARY.2_CAN_L GTR-20.CAN_LO_6 MFD.2_CAN_BUS_LO PFD.2_CAN_BUS_LO PITCH.CAN-L U$13.P$2 U$14.CAN_LO(4) YAW.CAN-L
COAX_ELT: ANT-ELT.1 U$7.ANT
CPM_S: U$5.L$3
CPM_W: CO-PILOT_MIC.2 U$5.L$26
CPM_WB: CO-PILOT_MIC.1 U$5.L$27
CPM_WO: CO-PILOT_MIC.5 U$5.L$28
CPP_S: U$5.L$25
CPP_W: CO-PILOT_PHONE.5 U$5.L$22
CPP_WB: CO-PILOT_PHONE.1 U$5.L$23
CPP_WO: CO-PILOT_PHONE.2 U$5.L$24
CWS_DISC_WB: PITCH.CWS/DISC SW_AUTOPILOT_DISC.1(P) U$13.P$15 YAW.CWS/DISC
D_WR: SW_TRIM_DOWN.2(S)
E01_WB: GTN650.P1002_24 GTX45R.P3252_1 GTX45R.P3252_6
E-BUSS: COIL_15.I D1.C D2.C IGN1_5.I IGN2_5.I
EI1_W: GTN650.P1002_25 GTX45R.P3252_7
EI1_WB: GTN650.P1002_26 GTX45R.P3252_2
ELT_REMOTE: U$7.REMOTE
ELT_W: U$7.4_GPS_RX
ELT_WB: U$7.3_GND
ELT_WO: AUX_FUSEBLOCK.14 U$7.1_PWR
EO1_W: GTN650.P1002_23
FLAP_WHT: U$1.J1_17
FLAP_WHT/BLU: U$1.J1_19
FLAP_WHT/ORN: U$1.J1_18
FLD_VREG_MAIN: 1224.FLD ALT_PRIMARY.F
GAD29_1_W: GAD29.J292_23 GTN650.P1001_9
GAD29_1_WB: GAD29.J292_11 GTN650.P1001_29
GAD29_2_W: GAD29.J292_24 GTN650.P1001_48
GAD29_2_WB: GAD29.J292_12 GTN650.P1001_67
GDL51_5_W: GDL51R.5_RS232_TX2
GDL51_6_WO: GDL51R.6_RS232_RX2
GDL51_7_W: GDL51R.7_RS232_TX1
GDL51_8_WO: GDL51R.8_RS232_RX1
GDL51_11_WB: GDL51R.4
GDL51_12_WB: GDL51R.12_SIGNAL_GND2
GEA24_RS232_W: GEA24.RS232_TX_5 PFD.23_RS-232-IN4
GEA24_RS232_WB: GEA24.RS232_RX_4 PFD.40_RS-232-OUT4
GMA245_29_W: GMA-245.J2401_29
GMA245_43_WB: GMA-245.J2401_43
GMA245_CPM_S: U$5.P$3
GMA245_CPM_W: U$5.P$26
GMA245_CPM_WB: GMA-245.J2402_32 GMA-245.J2402_34 U$5.P$27
GMA245_CPM_WO: GMA-245.J2402_33 U$5.P$28
GMA245_CPP_S: U$5.P$25
GMA245_CPP_W: GMA-245.2402_3 U$5.P$22
GMA245_CPP_WB: GMA-245.2402_2 U$5.P$23
GMA245_CPP_WO: GMA-245.2402_4 U$5.P$24
GMA245_E1_W: GDL51R.13_MUSIC_OUT_LEFT GMA-245.J2402_23
GMA245_E1_WB: GDL51R.14_MUSIC_OUT_COMMON GMA-245.J2402_25
GMA245_E1_WO: GDL51R.15_MUSIC_OUT_RIGHT GMA-245.J2402_24
GMA245_PAPH_S: U$5.P$7
GMA245_PAPH_W: GMA-245.J2401_40 U$5.P$4
GMA245_PAPH_WB: GMA-245.J2401_42 U$5.P$5
GMA245_PAPH_WO: GMA-245.J2401_41 U$5.P$6
GMA245_PLM_S: U$5.P$13
GMA245_PLM_W: GMA-245.J2402_37 U$5.P$11
GMA245_PLM_WB: GMA-245.J2402_38 U$5.P$12
GMA245_PM_S: U$5.P$21
GMA245_PM_W: GMA-245.J2401_33 U$5.P$18
GMA245_PM_WB: GMA-245.J2401_35 U$5.P$19
GMA245_PM_WO: GMA-245.J2401_34 U$5.P$20
GMA245_PP_S: U$5.P$17
GMA245_PP_W: GMA-245.J2402_16 U$5.P$14
GMA245_PP_WB: GMA-245.2402_1 U$5.P$15
GMA245_PP_WO: GMA-245.J2402_31 U$5.P$16
GMA245_PRM_S: U$5.P$10
GMA245_PRM_W: GMA-245.J2402_35 U$5.P$8
GMA245_PRM_WB: GMA-245.J2402_36 U$5.P$9
GND: ALT_BACKUP.G ALT_PRIMARY.G AVIONICS.1(O) AVIONICS.5(P1) EYEBALL_LIGHT.K(C) MASTER.1(O) MASTER.5(P1) PITOT_HEAT.B1 PITOT_HEAT.B2 REVERSIONARY.1B SW-XFEED.2(S) U$12.GND2
GND_AUTOPILOT_ROLL: U$13.P$9
GND_GAD29_1 [GND]: GAD29.GND1
GND_GAD29_2 [GND]: GAD29.GND2
GND_GDL_51 [GND]: GDL51R.9_GND
GND_GEA24_1_B [GND]: GEA24.J241_6
GND_GEA24_2_B [GND]: GEA24.J241_9
GND_GMA245_10 [GND]: GMA-245.2402_10 GMA-245.2402_11
GND_GMC307_GND2 [GND]: U$14.POWER_GND2(15)
GND_GSU25_BACK_1 [GND]: GSU25_BACKUP.6_GND1 GSU25_BACKUP.9_GND2
GND_GSU25_PRI_1 [GND]: GSU25_PRIMARY.6_GND1
GND_GSU25_PRI_2 [GND]: GSU25_PRIMARY.9_GND2
GND_GTN650 [GND]: GTN650.P1001_77 GTN650.P1001_78
GND_GTN650_COM1 [GND]: GTN650.P1003_37 GTN650.P1003_38 GTN650.P1003_40
GND_GTR20 [GND]: GTR-20.J2001_20
GND_GTX45R [GND]: GTX45R.P3251_20 GTX45R.P3251_38 GTX45R.P3251_41 GTX45R.P3251_59
GND_HOBBS: OIL_SWITCH.P$1
GND_IGN1 [GND]: SYSTEM_32_1.GND
GND_IGN2 [GND]: SYSTEM_32_2.GND
GND_KEYSWITCH [GND]: STARTER_SWITCH.GND
GND_MAIN [GND]: AUX.- MAIN.-
GND_MFD1 [GND]: MFD.15_PWR_GND1
GND_MFD2 [GND]: MFD.16_PWR_GND_2
GND_PFD1_B [GND]: PFD.15_PWR_GND1
GND_PFD2_B [GND]: PFD.16_PWR_GND_2
GND_PITCH_SERVO [GND]: PITCH.SERVO_GND
GND_VPX1 [GND]: U$1.J10_9
GND_VPX2 [GND]: U$1.J12_4
GND_VREG_MAIN [GND]: 1224.GND
GND_YAW_SERVO [GND]: YAW.SERVO_GND
GTN650_1001_7_W: GTN650.P1001_7
GTN650_1001_8_W: GTN650.P1001_8
GTN650_1001_26_WO: GTN650.P1001_26
GTN650_1001_27_WO: GTN650.P1001_27
GTN650_1001_45_WB: GTN650.P1001_45
GTN650_1001_46_WB: GTN650.P1001_46
HIGH_2: GSU25_PRIMARY.OAT_HIGH_2
HIGH_2_WB: GTP59.HIGH
IGN1_TACH: GEA24.J243_8 SYSTEM_32_1.TACH
IGN2_TACH: GEA24.J243_6 SYSTEM_32_2.TACH
J251_4_W: GSU25_PRIMARY.4_RS232_RX1
J251_5_WB: GSU25_PRIMARY.5_RS232_TX1
J252_6_WO: GSU25_PRIMARY.12V_MAG_PWR_6
J252_7_WBS: GSU25_PRIMARY.MAG_GND_7
J252_12_W: GSU25_PRIMARY.RS485_RXA_12
J252_13_WB: GSU25_PRIMARY.RS485_RXB_13
J252_15_W: GSU25_PRIMARY.RS232_TX2_15
L_B: SW_TRIM_LEFT.2(S)
LEFT_IGN_P_LEAD: STARTER_SWITCH.L SYSTEM_32_2.P-LEAD
LOW_3: GSU25_PRIMARY.OAT_LOW_3
LOW_3_WO: GTP59.LOW
MAIN_BUS(2GA) [PWR_MASTER]: D1.A MASTER_CONTACTOR2.IN MASTER_CONTACTOR.OUT U$1.PWR U$6.O
MAIN_CONTACTOR [Switches]: MASTER.2(P) MASTER_CONTACTOR.F
N1A_W: GMA-245.J2401_17 GTN650.P1004_16
N1A_WB: GMA-245.J2401_18 GTN650.P1004_17
N$1: AUX_FUSEBLOCK.1
N$2: ROLL.SERVO_GND U$13.L$9
N$3: PFD.17_CONFIG_MODULE_PWR_OUT U$4.RED
N$4: ROLL.SERVO_PWR U$13.L$10
N$6: ANL1.O ANL2.O U$2.IN U$6.I
N$7: ROLL.CAN-H U$13.L$1
N$8: ROLL.CAN-L U$13.L$2
N$9: ALT_PRIMARY.B ANL1.I
N$10: ALT_BACKUP.B ANL2.I
N$11: ROLL.CAN-TERM1 ROLL.CAN-TERM2
N$13: PFD.10_CDU_SYSTEM_ID_PRG_1 PFD.44_SIGNAL_GROUND6
N$14: ROLL_TRIM.WHITE_GREEN U$13.L$8
N$15: ROLL_TRIM.WHITE_ORANGE U$13.L$7
N$16: PFD.33_CONFIG_MODULE_CLOCK U$4.WHT
N$18: ROLL.CWS/DISC U$13.L$15
N$19: ROLL.TRIM_IN2 U$13.L$12
N$21: ROLL.TRIM_IN1 U$13.L$11
N$22: PFD.49_CONFIG_MODULE_GROUND U$4.BLK
N$23: GTN650.P1001_19 GTN650.P1001_20
N$24: AUX_FUSEBLOCK.IN_1 AUX_FUSEBLOCK.IN_2 U$10.I
N$25: AUX.+ MASTER_CONTACTOR1.IN MASTER_CONTACTOR2.OUT
N$26: PFD.50_CONFIG_MODULE_DATA U$4.YEL
N$27: IGN2_5.0 SYSTEM_32_2.ECU_PWR
N$28: IGN1_5.0 SYSTEM_32_1.ECU_PWR
N$29: ROLL.TRIM_OUT1 ROLL_TRIM.MOTOR2
N$30: ROLL.TRIM_OUT2 ROLL_TRIM.MOTOR1
N$31: COIL_15.0 SYSTEM_32_1.IGN_PWR SYSTEM_32_2.IGN_PWR
N$32: ROLL_TRIM.WHITE_BLUE U$13.L$6
N$33: GTN650.P1004_61
N$34: YAW.CAN-TERM1 YAW.CAN-TERM2
N$35: PITCH.ID_STRAP_1 PITCH.RS232_RX/STRAP4
N$36: YAW.ID_STRAP_2 YAW.RS232_TX/STRAP3
N$37: GTN650.P1004_62
N$38 [PWR_MASTER]: U$1.J12_8
P1M_S: U$5.L$10
P1M_W: PASSENGER1_MIC.2 U$5.L$8
P1M_WB: PASSENGER1_MIC.1 U$5.L$9
P2M_S: U$5.L$13
P2M_W [Analog]: PASSENGER2_MIC.2 U$5.L$11
P2M_WB [Analog]: PASSENGER2_MIC.1 U$5.L$12
PASSP_S: U$5.L$7
PASSP_W: PASSENGER1_PHONE.2 PASSENGER2_PHONE.2 U$5.L$4
PASSP_WB: PASSENGER1_PHONE.1 PASSENGER2_PHONE.1 U$5.L$5
PASSP_WO: PASSENGER1_PHONE.5 PASSENGER2_PHONE.5 U$5.L$6
PFD_1_W: PFD.1_MONO_AUDIO_OUT_HI
PFD_13_WO: PFD.13_RS-232-OUT3
PFD_14_W: PFD.14_RS-232-IN2
PFD_18_WB: PFD.18_MONO_AUDIO_OUT_LO
PFD_24_W: GTX45R.P3251_7 PFD.24_RS-232-IN5
PFD_27_WB: PFD.27_SIGNAL_GROUND1
PFD_29_W: PFD.29_RS-232-IN3
PFD_30_WO: PFD.30_RS-232-OUT2
PFD_34_WB: PFD.34_SIGNAL_GROUND2
PFD_37_WB: GTX45R.P3251_50 PFD.37_SIGNAL_GROUND5
PFD_41_WO: GTX45R.P3251_29 PFD.41_RS-232-OUT5
PFD_47_W: PFD.47_RS-232-IN1
PFD_48_WO: PFD.48_RS-232-OUT1
PITCH_SERVO_PWR: PITCH.SERVO_PWR
PITCH_WHT1: U$1.J1_11 U$13.P$11
PITCH_WHT2: U$1.J1_12 U$13.P$12
PITCH_WHT/BLU: U$1.J1_8
PITCH_WHT/GRN: U$1.J1_10
PITCH_WHT/ORN: U$1.J1_9
PM_S: U$5.L$21
PM_W: PILOT_MIC.2 U$5.L$18
PM_WB [Analog]: PILOT_MIC.1 U$5.L$19
PM_WO: PILOT_MIC.5 U$5.L$20
PP_S: U$5.L$17
PP_W: PILOT_PHONE.2 PILOT_PHONE.5 U$5.L$14
PP_WB: PILOT_PHONE.1 U$5.L$15
PP_WO: U$5.L$16
PT2_W: PITCH_TRIM.WHITE_GREEN
PT2_WB: PITCH_TRIM.WHITE_BLUE
PT2_WO: PITCH_TRIM.WHITE_ORANGE
PT_W: PITCH.TRIM_IN1 PITCH.TRIM_OUT2 PITCH_TRIM.MOTOR1
PT_WB: PITCH.TRIM_IN2 PITCH.TRIM_OUT1 PITCH_TRIM.MOTOR2
PWR_1: GSU25_PRIMARY.OAT_PWR_1
PWR_1_WO: GTP59.PWR
R_WB: SW_TRIM_RIGHT.2(S)
REVERISIONARY_MODE [Switches]: REVERSIONARY.NO
RIGHT_IGN_P_LEAD: STARTER_SWITCH.R SYSTEM_32_1.P-LEAD
ROLL_WHT1: U$1.J1_6
ROLL_WHT2: U$1.J1_7
ROLL_WHT/BLU: U$1.J1_3 U$13.P$6
ROLL_WHT/GRN: U$1.J1_5 U$13.P$8
ROLL_WHT/ORN: U$1.J1_4 U$13.P$7
S: U$11.1_SIGNAL_GND1 U$11.3_SIGNAL_GND2
SEN_AUX_VOLTAGE: AUX_FUSEBLOCK.11 GEA24.J244_28
SEN_FF_G_WB: FT-60.GND GEA24.J243_20
SEN_FF_SEN_W: FT-60.SENSOR GEA24.J243_23
SEN_FF_V_WO: FT-60.V+ GEA24.J243_24
SEN_FP_GND_WB: FUEL.GND GEA24.J243_1
SEN_FP_SEN_W: FUEL.SENSOR GEA24.J243_2
SEN_FP_V_WO: FUEL.V+ GEA24.J243_4
SEN_HOBBS: OIL_SWITCH.P$2 U$3.P$1
SEN_M_GND_WB: GEA24.J243_12 MANIFOLD.GND
SEN_M_SEN_W: GEA24.J243_13 MANIFOLD.SENSOR
SEN_M_V_W0: GEA24.J243_15 MANIFOLD.V+
SEN_O_GND_WB: GEA24.J243_16 OIL.GND
SEN_O_SEN_W: GEA24.J243_17 OIL.SENSOR
SEN_O_V_WO: GEA24.J243_19 OIL.V+
SEN_OIL_TEMP_W: GEA24.J243_33 U$8.P$1
SEN_OIL_TEMP_WB: GEA24.J243_32 U$8.P$2
SEN_SHUNT2_HI_W: GEA24.J243_35 U$10.2
SEN_SHUNT2_LO_WB: GEA24.J243_34 U$10.1
SS_BLUE: POSI-STROBE.SYNC
STARTER_CONTACTOR: STARTER_SWITCH.S U$2.S
STARTER_PWR [PWR_MASTER]: U$2.OUT
SW_ALT1: ALT_SEL.4(O1) U$1.J2_1
SW_ALT2: ALT_SEL.1(O) U$1.J2_8
SW_ALT_EN [Switches]: MASTER.4(O1)
SW_AUTOPILOT [Switches]: SW_AUTOPILOT_C.2(S) U$1.J2_2
SW_AVIONICS_MASTER [Switches]: AVIONICS.4(O1) U$1.J2_3
SW_BOOST [Switches]: SW_BOOST.2(S) U$1.J2_4
SW_FLAP_DWN [Switches]: U$1.J2_15
SW_FLAP_UP [Switches]: U$1.J2_14
SW_LANDING [Switches]: SW_LT.6(S1) U$1.J2_5
SW_NAV: SW_STROBE_C.3(S) U$1.J2_7
SW_PITCH_DWN [Switches]: U$1.J2_19
SW_PITCH_UP [Switches]: U$1.J2_18
SW_PITOT [Switches]: SW_PITOT_C.2(S) U$1.J2_9
SW_ROLL_LEFT [Switches]: U$1.J2_16
SW_ROLL_RIGHT [Switches]: U$1.J2_17
SW_STROBE: SW_STROBE_C.4(O1) U$1.J2_10
SW_TAXI [Switches]: SW_LT.3(S) U$1.J2_6
T2_W: GTX45R.P3251_30 MFD.41_RS-232-OUT5
T2_WB: GTX45R.P3251_51 MFD.37_SIGNAL_GROUND5
T2_WO: GTX45R.P3251_8 MFD.24_RS-232-IN5
T3_W: GSU25_PRIMARY.RS232_TX3_9 GTX45R.P3251_31
T3_W0: GSU25_PRIMARY.RS232_RX3_10 GTX45R.P3251_9
T3_WB: GSU25_PRIMARY.GND3_11 GTX45R.P3251_52
TOGO: GEA24.J244_41 GTN650.P1002_10
TS_W: POSI-STROBE.GND
TS_WB: POSI-STROBE.POSITION
TS_WO: POSI-STROBE.STROBE
U_R: SW_TRIM_UP.2(S)
USB_GND_WB: USB_CHGR.P$4
USB_POS_W: USB_CHGR.P$1
VPX_ACCESORIES [PWR_MASTER]: U$1.J10_6
VPX_ALT1 [PWR_MASTER]: 1224.AUX 1224.ENABLE 1224.SENSE U$1.J12_1 U$1.J12_11
VPX_ALT2 [PWR_MASTER]: ALT_BACKUP.F U$1.J10_10
VPX_BOOST [PWR_MASTER]: U$1.J10_5
VPX_FLAP_1 [PWR_MASTER]: U$1.J12_5
VPX_FLAP_2 [PWR_MASTER]: U$1.J12_6
VPX_GAD_29 [PWR_MASTER]: GAD29.PWR1 U$1.J8_6
VPX_GAP_26 [PWR_MASTER]: PITOT_HEAT.P1 PITOT_HEAT.P2 U$1.J10_3
VPX_GDL_51R [PWR_MASTER]: GDL51R.10_PWR U$1.J1_1
VPX_GEA_24_R [PWR_MASTER]: GEA24.J241_7 U$1.J8_3
VPX_GMA_245 [PWR_MASTER]: U$1.J1_2
VPX_GMC_307 [PWR_MASTER]: U$1.J10_8 U$14.AIRCRAFT_POWER1(7)
VPX_GSA_28_1 [PWR_MASTER]: U$1.J10_2
VPX_GSA_28_2 [PWR_MASTER]: U$1.J10_4 U$13.P$10
VPX_GSA_28_3 [PWR_MASTER]: U$1.J10_7
VPX_GSU_25_1 [PWR_MASTER]: GSU25_PRIMARY.7_AIRCRAFT_POWER1 U$1.J8_4
VPX_GSU_25_2 [PWR_MASTER]: GSU25_BACKUP.7_AIRCRAFT_POWER1 U$1.J8_7
VPX_GTN_650_COM1 [PWR_MASTER]: GTN650.P1003_30 GTN650.P1003_43 GTN650.P1003_44 U$1.J12_3
VPX_GTN_650_NAV1 [PWR_MASTER]: GTN650.P1004_51 GTN650.P1004_52 U$1.J8_5
VPX_GTR20 [PWR_MASTER]: GTR-20.J2001_1 U$1.J8_2
VPX_GTX_45R [PWR_MASTER]: GTX45R.P3251_21 GTX45R.P3251_42 U$1.J12_10
VPX_LIGHT_LANDING [PWR_MASTER]: U$1.J12_2
VPX_LIGHT_TAXI [PWR_MASTER]: U$1.J12_7
VPX_MFD [PWR_MASTER]: U$1.J8_8
VPX_PFD [PWR_MASTER]: PFD.AIRCRAFT_POWER_1 U$1.J12_9
VPX_SERIAL_W: MFD.29_RS-232-IN3 U$1.J1_20
VPX_SERIAL_WB: MFD.35_SIGNAL_GROUND3 U$1.J1_21
VPX_SERIAL_WO: MFD.13_RS-232-OUT3 U$1.J1_22
VPX_STARTER [PWR_MASTER]: STARTER_SWITCH.PWR U$1.J10_1
VPX_STROBE [PWR_MASTER]: U$1.J12_12
X-FEED_CONTACTOR [Switches]: MASTER_CONTACTOR2.F SW-XFEED.1(P)
YAW_SERVO_PWR: YAW.SERVO_PWR
Unconnected: 1224.DUAL_IN 1224.DUAL_OUT 1224.LAMP ALT_SEL.2(P) ALT_SEL.3(S) ALT_SEL.5(P1) ALT_SEL.6(S1) AUX_FUSEBLOCK.2 AUX_FUSEBLOCK.4 AUX_FUSEBLOCK.6 AUX_FUSEBLOCK.7 AUX_FUSEBLOCK.8 AUX_FUSEBLOCK.12 AVIONICS.3(S) AVIONICS.6(S1) CO-PILOT_MIC.3 CO-PILOT_MIC.4 CO-PILOT_PHONE.3 CO-PILOT_PHONE.4 COWL_FLAP.1(P) COWL_FLAP.2(S) GAD29.J292_1 GAD29.J292_2 GAD29.J292_3 GAD29.J292_4 GAD29.J292_5 GAD29.J292_6 GAD29.J292_7 GAD29.J292_8 GAD29.J292_9 GAD29.J292_13 GAD29.J292_14 GAD29.J292_15 GAD29.J292_16 GAD29.J292_17 GAD29.J292_18 GAD29.J292_19 GAD29.J292_20 GAD29.J292_21 GAD29.RES1 GAD29.RES2 GAD29.RES3 GDL51R.1 GDL51R.2 GDL51R.3 GDL51R.11_SIGNAL_GND1 GEA24.J241_3 GEA24.J242_1 GEA24.J242_2 GEA24.J242_3 GEA24.J242_4 GEA24.J242_5 GEA24.J242_6 GEA24.J242_7 GEA24.J242_8 GEA24.J242_9 GEA24.J242_10 GEA24.J242_11 GEA24.J242_12 GEA24.J242_13 GEA24.J242_14 GEA24.J242_15 GEA24.J242_16 GEA24.J242_17 GEA24.J242_18 GEA24.J242_19 GEA24.J242_20 GEA24.J242_21 GEA24.J242_22 GEA24.J242_23 GEA24.J242_24 GEA24.J242_25 GEA24.J243_3 GEA24.J243_5 GEA24.J243_7 GEA24.J243_9 GEA24.J243_10 GEA24.J243_11 GEA24.J243_14 GEA24.J243_18 GEA24.J243_21 GEA24.J243_22 GEA24.J243_25 GEA24.J243_26 GEA24.J243_27 GEA24.J243_28 GEA24.J243_29 GEA24.J243_30 GEA24.J243_31 GEA24.J243_36 GEA24.J243_37 GEA24.J244_1 GEA24.J244_2 GEA24.J244_3 GEA24.J244_4 GEA24.J244_5 GEA24.J244_6 GEA24.J244_7 GEA24.J244_8 GEA24.J244_9 GEA24.J244_10 GEA24.J244_11 GEA24.J244_12 GEA24.J244_13 GEA24.J244_14 GEA24.J244_15 GEA24.J244_16 GEA24.J244_17 GEA24.J244_18 GEA24.J244_19 GEA24.J244_20 GEA24.J244_21 GEA24.J244_22 GEA24.J244_23 GEA24.J244_24 GEA24.J244_25 GEA24.J244_26 GEA24.J244_27 GEA24.J244_29 GEA24.J244_30 GEA24.J244_31 GEA24.J244_32 GEA24.J244_33 GEA24.J244_34 GEA24.J244_35 GEA24.J244_36 GEA24.J244_37 GEA24.J244_38 GEA24.J244_39 GEA24.J244_40 GEA24.J244_42 GEA24.J244_43 GEA24.J244_44 GEA24.J244_45 GEA24.J244_46 GEA24.J244_47 GEA24.J244_48 GEA24.J244_49 GEA24.J244_50 GMA-245.2402_6 GMA-245.2402_7 GMA-245.2403_5 GMA-245.J2401_1 GMA-245.J2401_2 GMA-245.J2401_3 GMA-245.J2401_4 GMA-245.J2401_5 GMA-245.J2401_6 GMA-245.J2401_7 GMA-245.J2401_8 GMA-245.J2401_16 GMA-245.J2401_19 GMA-245.J2401_20 GMA-245.J2401_21 GMA-245.J2401_22 GMA-245.J2401_23 GMA-245.J2401_24 GMA-245.J2401_25 GMA-245.J2401_26 GMA-245.J2401_27 GMA-245.J2401_28 GMA-245.J2401_36 GMA-245.J2401_38 GMA-245.J2401_39 GMA-245.J2401_44 GMA-245.J2402_12 GMA-245.J2402_13 GMA-245.J2402_14 GMA-245.J2402_15 GMA-245.J2402_17 GMA-245.J2402_18 GMA-245.J2402_19 GMA-245.J2402_20 GMA-245.J2402_21 GMA-245.J2402_22 GMA-245.J2402_26 GMA-245.J2402_27 GMA-245.J2402_28 GMA-245.J2402_29 GMA-245.J2402_30 GMA-245.J2402_39 GMA-245.J2402_40 GMA-245.J2402_41 GMA-245.J2402_42 GMA-245.J2402_43 GMA-245.J2402_44 GSU25_BACKUP.3_RSV GSU25_BACKUP.4_RS232_RX1 GSU25_BACKUP.5_RS232_TX1 GSU25_BACKUP.8_AIRCRAFT_POWER2 GSU25_BACKUP.12V_MAG_PWR_6 GSU25_BACKUP.GND3_11 GSU25_BACKUP.GND4_14 GSU25_BACKUP.MAG_GND_7 GSU25_BACKUP.OAT_HIGH_2 GSU25_BACKUP.OAT_LOW_3 GSU25_BACKUP.OAT_PWR_1 GSU25_BACKUP.RS232_RX3_10 GSU25_BACKUP.RS232_TX2_15 GSU25_BACKUP.RS232_TX3_9 GSU25_BACKUP.RS485_RXA_12 GSU25_BACKUP.RS485_RXB_13 GSU25_BACKUP.RSV2_8 GSU25_PRIMARY.3_RSV GSU25_PRIMARY.GND4_14 GSU25_PRIMARY.RSV2_8 GSU25_PRIMARY.UNIT_ID1_GND_4 GSU25_PRIMARY.UNIT_ID_5 GTN650.P1001_1 GTN650.P1001_2 GTN650.P1001_3 GTN650.P1001_5 GTN650.P1001_6 GTN650.P1001_10 GTN650.P1001_11 GTN650.P1001_12 GTN650.P1001_13 GTN650.P1001_14 GTN650.P1001_15 GTN650.P1001_16 GTN650.P1001_17 GTN650.P1001_18 GTN650.P1001_21 GTN650.P1001_22 GTN650.P1001_24 GTN650.P1001_25 GTN650.P1001_28 GTN650.P1001_30 GTN650.P1001_31 GTN650.P1001_32 GTN650.P1001_33 GTN650.P1001_34 GTN650.P1001_35 GTN650.P1001_36 GTN650.P1001_37 GTN650.P1001_38 GTN650.P1001_39 GTN650.P1001_40 GTN650.P1001_41 GTN650.P1001_42 GTN650.P1001_43 GTN650.P1001_44 GTN650.P1001_47 GTN650.P1001_49 GTN650.P1001_50 GTN650.P1001_51 GTN650.P1001_52 GTN650.P1001_53 GTN650.P1001_54 GTN650.P1001_55 GTN650.P1001_56 GTN650.P1001_57 GTN650.P1001_58 GTN650.P1001_59 GTN650.P1001_60 GTN650.P1001_61 GTN650.P1001_62 GTN650.P1001_63 GTN650.P1001_64 GTN650.P1001_65 GTN650.P1001_66 GTN650.P1001_68 GTN650.P1001_69 GTN650.P1001_70 GTN650.P1001_71 GTN650.P1001_72 GTN650.P1001_73 GTN650.P1001_74 GTN650.P1001_75 GTN650.P1001_76 GTN650.P1002_1 GTN650.P1002_2 GTN650.P1002_3 GTN650.P1002_4 GTN650.P1002_5 GTN650.P1002_6 GTN650.P1002_7 GTN650.P1002_8 GTN650.P1002_9 GTN650.P1002_11 GTN650.P1002_12 GTN650.P1002_13 GTN650.P1002_14 GTN650.P1002_15 GTN650.P1002_16 GTN650.P1002_17 GTN650.P1002_18 GTN650.P1002_19 GTN650.P1002_20 GTN650.P1002_21 GTN650.P1002_22 GTN650.P1003_1 GTN650.P1003_2 GTN650.P1003_3 GTN650.P1003_4 GTN650.P1003_6 GTN650.P1003_8 GTN650.P1003_9 GTN650.P1003_10 GTN650.P1003_12 GTN650.P1003_13 GTN650.P1003_14 GTN650.P1003_15 GTN650.P1003_16 GTN650.P1003_17 GTN650.P1003_19 GTN650.P1003_21 GTN650.P1003_22 GTN650.P1003_23 GTN650.P1003_24 GTN650.P1003_25 GTN650.P1003_26 GTN650.P1003_27 GTN650.P1003_28 GTN650.P1003_29 GTN650.P1003_31 GTN650.P1003_32 GTN650.P1003_33 GTN650.P1003_34 GTN650.P1003_35 GTN650.P1003_36 GTN650.P1003_39 GTN650.P1003_41 GTN650.P1003_42 GTN650.P1004_1 GTN650.P1004_2 GTN650.P1004_3 GTN650.P1004_4 GTN650.P1004_5 GTN650.P1004_6 GTN650.P1004_7 GTN650.P1004_8 GTN650.P1004_9 GTN650.P1004_10 GTN650.P1004_11 GTN650.P1004_12 GTN650.P1004_13 GTN650.P1004_14 GTN650.P1004_15 GTN650.P1004_18 GTN650.P1004_19 GTN650.P1004_20 GTN650.P1004_21 GTN650.P1004_22 GTN650.P1004_25 GTN650.P1004_26 GTN650.P1004_27 GTN650.P1004_28 GTN650.P1004_29 GTN650.P1004_30 GTN650.P1004_31 GTN650.P1004_32 GTN650.P1004_33 GTN650.P1004_34 GTN650.P1004_35 GTN650.P1004_36 GTN650.P1004_37 GTN650.P1004_38 GTN650.P1004_39 GTN650.P1004_40 GTN650.P1004_41 GTN650.P1004_42 GTN650.P1004_43 GTN650.P1004_44 GTN650.P1004_45 GTN650.P1004_46 GTN650.P1004_47 GTN650.P1004_48 GTN650.P1004_49 GTN650.P1004_50 GTN650.P1004_53 GTN650.P1004_54 GTN650.P1004_55 GTN650.P1004_56 GTN650.P1004_57 GTN650.P1004_58 GTN650.P1004_59 GTN650.P1004_60 GTR-20.J2001_2 GTR-20.J2001_3 GTR-20.J2001_4 GTR-20.J2001_8 GTR-20.J2001_9 GTR-20.J2001_11 GTR-20.J2001_12 GTR-20.J2001_13 GTR-20.J2001_14 GTR-20.J2001_15 GTR-20.J2001_16 GTR-20.J2001_18 GTR-20.J2001_19 GTR-20.J2001_21 GTR-20.J2001_22 GTR-20.J2001_23 GTR-20.J2001_24 GTR-20.J2001_25 GTR-20.J2001_26 GTR-20.J2001_27 GTR-20.J2001_28 GTR-20.J2001_30 GTR-20.J2001_31 GTR-20.J2001_32 GTR-20.J2001_33 GTR-20.J2001_34 GTR-20.J2001_37 GTX45R.P3251_1 GTX45R.P3251_2 GTX45R.P3251_3 GTX45R.P3251_4 GTX45R.P3251_5 GTX45R.P3251_6 GTX45R.P3251_10 GTX45R.P3251_11 GTX45R.P3251_12 GTX45R.P3251_13 GTX45R.P3251_14 GTX45R.P3251_15 GTX45R.P3251_16 GTX45R.P3251_17 GTX45R.P3251_18 GTX45R.P3251_19 GTX45R.P3251_22 GTX45R.P3251_23 GTX45R.P3251_24 GTX45R.P3251_25 GTX45R.P3251_26 GTX45R.P3251_27 GTX45R.P3251_28 GTX45R.P3251_32 GTX45R.P3251_33 GTX45R.P3251_34 GTX45R.P3251_35 GTX45R.P3251_36 GTX45R.P3251_37 GTX45R.P3251_39 GTX45R.P3251_40 GTX45R.P3251_43 GTX45R.P3251_44 GTX45R.P3251_45 GTX45R.P3251_46 GTX45R.P3251_47 GTX45R.P3251_48 GTX45R.P3251_49 GTX45R.P3251_53 GTX45R.P3251_54 GTX45R.P3251_55 GTX45R.P3251_56 GTX45R.P3251_57 GTX45R.P3251_58 GTX45R.P3251_60 GTX45R.P3252_3 GTX45R.P3252_4 GTX45R.P3252_5 GTX45R.P3252_8 GTX45R.P3252_9 GTX45R.P3252_10 GTX45R.P3252_11 GTX45R.P3252_12 GTX45R.P3252_13 GTX45R.P3252_14 GTX45R.P3252_15 MASTER.3(S) MASTER.6(S1) MFD.1_MONO_AUDIO_OUT_HI MFD.2_STEREO_AUDIO_OUT_LO1 MFD.3_RESERVED MFD.3_STEREO_AUDIO_OUT_LEFT MFD.4_RS_232_TX MFD.4_SPARE1 MFD.5_RS-232-RX MFD.5_SPARE2 MFD.6_DNU1 MFD.6_GND1 MFD.7_DNU2 MFD.7_PWR1 MFD.8_DNU3 MFD.8_PWR2 MFD.9_CDU_SYSTEM_ID_PRG_2 MFD.9_GND2 MFD.10_CDU_SYSTEM_ID_PRG_1 MFD.11_DNU4 MFD.12_DNU5 MFD.17_CONFIG_MODULE_PWR_OUT MFD.18_MONO_AUDIO_OUT_LO MFD.19_STEREO_AUDIO_OUT_RIGHT MFD.20_STEREO_AUDIO_OUT_LO2 MFD.21_DNU6 MFD.22_DNU7 MFD.23_RS-232-IN4 MFD.25_CDU_SYSTEM_ID_PRG_3 MFD.26_28V_LIGHTING_BUS_HI MFD.27_SIGNAL_GROUND1 MFD.33_CONFIG_MODULE_CLOCK MFD.36_SIGNAL_GROUND4 MFD.38_DNU8 MFD.39_DNU9 MFD.40_RS-232-OUT4 MFD.42_CDU_SYSTEM_ID_PRG4 MFD.43_14V_LIGHTING_BUS_HI MFD.44_SIGNAL_GROUND6 MFD.45_CAN_BUS_LO_2 MFD.46_CAN_BUS_HI_2 MFD.47_RS-232-IN1 MFD.48_RS-232-OUT1 MFD.49_CONFIG_MODULE_GROUND MFD.50_CONFIG_MODULE_DATA MFD.AIRCRAFT_POWER_1 MFD.AIRCRAFT_POWER_2 MFD.CAN_BUS_TERM PASSENGER1_MIC.3 PASSENGER1_MIC.4 PASSENGER1_MIC.5 PASSENGER1_PHONE.3 PASSENGER1_PHONE.4 PASSENGER2_MIC.3 PASSENGER2_MIC.4 PASSENGER2_MIC.5 PASSENGER2_PHONE.3 PASSENGER2_PHONE.4 PFD.2_STEREO_AUDIO_OUT_LO1 PFD.3_RESERVED PFD.3_STEREO_AUDIO_OUT_LEFT PFD.4_SPARE1 PFD.5_SPARE2 PFD.6_DNU1 PFD.6_GND1 PFD.7_DNU2 PFD.7_PWR1 PFD.8_DNU3 PFD.8_PWR2 PFD.9_CDU_SYSTEM_ID_PRG_2 PFD.9_GND2 PFD.11_DNU4 PFD.12_DNU5 PFD.19_STEREO_AUDIO_OUT_RIGHT PFD.20_STEREO_AUDIO_OUT_LO2 PFD.21_DNU6 PFD.22_DNU7 PFD.25_CDU_SYSTEM_ID_PRG_3 PFD.26_28V_LIGHTING_BUS_HI PFD.35_SIGNAL_GROUND3 PFD.36_SIGNAL_GROUND4 PFD.38_DNU8 PFD.39_DNU9 PFD.42_CDU_SYSTEM_ID_PRG4 PFD.43_14V_LIGHTING_BUS_HI PFD.45_CAN_BUS_LO_2 PFD.46_CAN_BUS_HI_2 PFD.CAN_BUS_TERM PILOT_MIC.3 PILOT_MIC.4 PILOT_PHONE.3 PILOT_PHONE.4 PITCH.CAN-TERM1 PITCH.CAN-TERM2 PITCH.ID_STRAP_2 PITCH.RS232_TX/STRAP3 REVERSIONARY.1A REVERSIONARY.NC ROLL.ID_STRAP_1 ROLL.ID_STRAP_2 ROLL.RS232_RX/STRAP4 ROLL.RS232_TX/STRAP3 SW_AUTOPILOT_C.1(P) SW_AUTOPILOT_DISC.2(S) SW_BOOST.1(P) SW_LT.1(O) SW_LT.2(P) SW_LT.4(O1) SW_LT.5(P1) SW_PITOT_C.1(P) SW_STROBE_C.1(O) SW_STROBE_C.2(P) SW_STROBE_C.5(P1) SW_STROBE_C.6(S1) SW_TRIM_DOWN1.1(P) SW_TRIM_DOWN1.2(S) SW_TRIM_DOWN.1(P) SW_TRIM_LEFT1.1(P) SW_TRIM_LEFT1.2(S) SW_TRIM_LEFT.1(P) SW_TRIM_RIGHT1.1(P) SW_TRIM_RIGHT1.2(S) SW_TRIM_RIGHT.1(P) SW_TRIM_UP1.1(P) SW_TRIM_UP1.2(S) SW_TRIM_UP.1(P) U$1.J1_13 U$1.J1_14 U$1.J1_15 U$1.J1_16 U$1.J2_11 U$1.J2_12 U$1.J2_13 U$1.J8_1 U$5.L$1 U$5.L$2 U$5.P$1 U$5.P$2 U$7.2_GPS_TEST U$11.5_SPARE1 U$11.7_SPARE2 U$12.GND1 U$12.P$1 U$12.P$2 U$12.P$3 U$12.P$4 U$12.P$5 U$12.P$6 U$12.P$7 U$12.P$8 U$12.P$9 U$12.P$10 U$12.P$11 U$12.P$12 U$12.P$13 U$12.P$14 U$12.P$15 U$12.P$16 U$12.P$17 U$12.P$18 U$12.P$19 U$12.P$20 U$12.P$21 U$12.P$22 U$12.P$23 U$12.P$24 U$12.P$25 U$12.P$26 U$12.P$27 U$12.P$28 U$12.P$29 U$12.P$30 U$12.P$31 U$12.P$32 U$12.P$33 U$12.P$34 U$12.P$35 U$12.P$36 U$12.P$37 U$12.P$38 U$12.P$39 U$12.P$40 U$13.L$3 U$13.L$4 U$13.L$5 U$13.L$13 U$13.L$14 U$13.P$3 U$13.P$4 U$13.P$5 U$13.P$13 U$13.P$14 U$14.CAN_BUS_TERM(6) U$14.CAN_BUS_TERM(8) U$14.LIGHTING_BUS_HI(11) U$14.RESERVED(1) U$14.RESERVED(2) U$14.RESERVED(5) U$14.RESERVED(12) U$14.RESERVED(13) U$14.RESERVED(14) U$14.TO/GA(10) USB_CHGR.P$2 USB_CHGR.P$3 YAW.ID_STRAP_1 YAW.RS232_RX/STRAP4 YAW.TRIM_IN1 YAW.TRIM_IN2 YAW.TRIM_OUT1 YAW.TRIM_OUT2

### Buses
TAIL_STROBE:GND_STROBE,TS_S,TS_W,TS_WB,TS_WO,VPX_LIGHT_NAV
PITCH_TRIM1:PT_W,PT_WB,PT_S
PITCH_TRIM2:PT2_W,PT2_WB,PT2_WO,PT2_S
GMU_22_PWR:441_9_WO,441_6_WB,441_8_W,J252_15_W,J252_6_WO,J252_7_WBS
GMU_22_485:S,441_2_WB,441_4_W,J252_13_WB,J252_12_W,S
PITCH_TRIM_2:PT_W,PT_WB,PT_S
OAT:LOW_3_WO,HIGH_2_WB,PWR_1_WO
PFD_RS232_5:PFD_37_WB,PFD_24_W,PFD_41_WO,S
PFD_RS232_1:GTN650_1001_27_WO,GTN650_1001_8_W,GTN650_1001_46_WB,PFD_47_W,PFD_48_WO,PFD_27_WB,S
PFD_RS232_2:GTN650_1001_26_WO,GTN650_1001_45_WB,GTN650_1001_7_W,PFD_14_W,PFD_30_WO,PFD_34_WB,S
PFD_RS232_3:PFD_13_WO,PFD_29_W,PFD_36_WB,S,GDL51_5_W,GDL51_6_WO,GDL51_12_WB
PFD_RS232_5:4601_4_W,4601_5_WB,J251_4_W,J251_5_WB,S
MFD_RS232_2:S,4602_14_W,4602_30_WO,4602_34_WB,GDL51_7_W,GDL51_8_WO,GDL51_11_WB
CAN_BUS:CAN_HI_W,CAN_LO_WB
GAD29_1:GAD29_1_W,GAD29_1_WB,GAD29_1_S
GAD29_2:GAD29_2_W,GAD29_2_WB,GAD29_2_S
TRIM:U_R,D_WR,L_B,R_WB
USB_PWR:USB_POS_W,USB_GND_WB,USB_S
PASS_PHONE:PASSP_W,PASSP_WO,PASSP_WB,PASSP_S
PASSR_MIC:P1M_W,P1M_WB,P1M_S
PASSL_MIC:P2M_W,P2M_WB,P2M_S
PILOT_PHONE:PP_WO,PP_S,PP_W,PP_WB
PILOT_MIC:PM_W,PM_WO,PM_WB,PM_S
CO-PILOT_PHONE:CPP_WO,CPP_S,CPP_W,CPP_WB
CO-PILOT_MIC:CPM_W,CPM_WB,CPM_WO,CPM_S
GMA245_PILOT_PHONES:GMA245_PP_W,GMA245_PP_WB,GMA245_PP_WO,GMA245_PP_S
GMA245_PASS_RIGHT_MIC:GMA245_PRM_W,GMA245_PRM_WB,GMA245_PRM_S
GMA245_PASS_LEFT_MIC:GMA245_PLM_W,GMA245_PLM_WB,GMA245_PLM_S
GMA245_COPILOT_PHONES:GMA245_CPP_W,GMA245_CPP_WB,GMA245_CPP_WO,GMA245_CPP_S
GMA245_COPILOT_MIC:GMA245_CPM_W,GMA245_CPM_WB,GMA245_CPM_WO,GMA245_CPM_S
GMA245_PASS_PHONE:GMA245_PAPH_W,GMA245_PAPH_WB,GMA245_PAPH_WO,GMA245_PAPH_S
GMA245_PILOT_MIC:GMA245_PM_W,GMA245_PM_WB,GMA245_PM_WO,GMA245_PM_S
ENT1:GMA245_E1_W,GMA245_E1_WB,GMA245_E1_WO,GMA245_E1_S
GEA24_RS232:GEA24_RS232_W,GEA24_RS232_WB,GEA24_RS232_S
VPX_SERIAL:VPX_SERIAL_W,VPX_SERIAL_WB,VPX_SERIAL_WO,VPX_SERIAL_S
AUDIO_ALERT:PFD_1_W,PFD_18_WB,GMA245_29_W,GMA245_43_WB
CAN_BUS:CAN_HI_W,CAN_LO_WB,CAN_S
COM1AUDIO:C1A_W,C1A_WB,C1A_S
COM1MIC:C1M_W,C1M_WB,C1M_WO,C1M_S,C1A_WB
COM2_AUDIO:C2A_W,C2A_WB,C2A_S,C2M_WB
COM2_MIC:C2M_W,C2M_WB,C2M_WO,C2M_S
NAV1_AUDIO:N1A_W,N1A_WB,N1A_S
ALERT1:A1_W,A1_WB,A1
ETHER_OUT1:EO1_W,E01_WB,E01_S
ETHERIN1:EI1_W,EI1_WB,EI1_S
TRANS2:T2_W,T2_WB,T2_WO,T2_S
TRANS3:T3_W,T3_WB,T3_W0,T3_S
ARNIC_VOR:AV_W,AV_WB,AV_S
ELT:ELT_W,ELT_WB,ELT_WO

### Notes on the sheet
- Power-Deuce-Schottky
- Tail | Done
- Done
- Done
- Done
- Done
- AUX_BUSS_Voltage
- Mid-Fuse

## Sheet 2 of 2

## Library data of the parts
1224 = EAA:PLANEPWR_VREG; _EXTERNAL_: _EXTERNAL_
ALT_BACKUP ALT_PRIMARY = EAA:PLANE_POWER; _EXTERNAL_: _EXTERNAL_
ALT_SEL AVIONICS MASTER SW_LT SW_STROBE_C = switch:TL46YO: TINY SWITCH ON - ON Source: http://www2.produktinfo.conrad.com/datenblaetter/700000-724999/705152-da-01-de-Subminiaturschalter_TL_36YO.pdf; SPICEPREFIX: X
ANL1 ANL2 = EAA:ANL; _EXTERNAL_: _EXTERNAL_
ANT-ELT = discrete:ANTENNA: Antenna
AUX MAIN = battery:SL-160AA/PR: LI BATTERY Sonnenschein
AUX_FUSEBLOCK = EAA:11-13348; _EXTERNAL_: _EXTERNAL_
CO-PILOT_MIC CO-PILOT_PHONE PASSENGER1_MIC PASSENGER1_PHONE PASSENGER2_MIC PASSENGER2_PHONE PILOT_MIC PILOT_PHONE = con-hirschmann:PG203J: MIC/HEADPHONE JACK KS-S stereo microphone/headphone jack PG203JN (Schukat); OC_FARNELL: unknown; OC_NEWARK: unknown
COIL_15 IGN1_5 IGN2_5 = EAA:BREAKER; _EXTERNAL_: _EXTERNAL_
COWL_FLAP SW-XFEED SW_AUTOPILOT_C SW_AUTOPILOT_DISC SW_BOOST SW_PITOT_C SW_TRIM_DOWN SW_TRIM_DOWN1 SW_TRIM_LEFT SW_TRIM_LEFT1 SW_TRIM_RIGHT SW_TRIM_RIGHT1 SW_TRIM_UP SW_TRIM_UP1 = switch-omron:31-XX: OMRON SWITCH; MPN: B3F-3100; OC_FARNELL: 959704; OC_NEWARK: 36M3582
D1 D2 = diode:SCHOTTKY-DIODE: Schottky Diode
EYEBALL_LIGHT = led:LED: LED OSRAM: - CHIPLED LG R971, LG N971, LY N971, LG Q971, LY Q971, LO R971, LY R971 LH N974, LH R974 LS Q976, LO Q976, LY Q976 LO Q996 - Hyper CHIPLED LW Q18S LB Q993, LB Q99A, LB R99A - SideLED LS A670, LO A670, LY A670, LG A670, LP A670 LB A673, LV A673, LT A673, LW A673 LH A674 LY A675 LS A676, LA A676, LO A676, LY A676, LW A676 LS A679, LY A679, LG A679 - Hyper Micro SIDELED® LS Y876, LA Y876, LO Y876, LY Y876 LT Y87S - SmartLED LW L88C, LW L88S LB L89C, LB L89S, LG L890 LS L89K, LO L89K, LY L89K LS L896, LA L896, LO L896, LY L896 - TOPLED LS T670, LO T670, LY T670, LG T670, LP T670 LSG T670, LSP T670, LSY T670, LOP T670, LYG T670 LG T671, LOG T671, LSG T671 LB T673, LV T673, LT T673, LW T673 LH T674 LS T676, LA T676, LO T676, LY T676, LB T676, LH T676, LSB T676, LW T676 LB T67C, LV T67C, LT T67C, LS T67K, LO T67K, LY T67K, LW E67C LS E67B, LA E67B, LO E67B, LY E67B, LB E67C, LV E67C, LT E67C LW T67C LS T679, LY T679, LG T679 LS T770, LO T770, LY T770, LG T770, LP T770 LB T773, LV T773, LT T773, LW T773 LH T774 LS E675, LA E675, LY E675, LS T675 LS T776, LA T776, LO T776, LY T776, LB T776 LHGB T686 LT T68C, LB T68C - Hyper Mini TOPLED® LB M676 - Mini TOPLED Santana® LG M470 LS M47K, LO M47K, LY M47K Source: http://www.osram.convergy.de LUXEON: - LUMILED® LXK2-PW12-R00, LXK2-PW12-S00, LXK2-PW14-U00, LXK2-PW14-V00 LXK2-PM12-R00, LXK2-PM12-S00, LXK2-PM14-U00 LXK2-PE12-Q00, LXK2-PE12-R00, LXK2-PE12-S00, LXK2-PE14-T00, LXK2-PE14-U00 LXK2-PB12-K00, LXK2-PB12-L00, LXK2-PB12-M00, LXK2-PB14-N00, LXK2-PB14-P00, LXK2-PB14-Q00 LXK2-PR12-L00, LXK2-PR12-M00, LXK2-PR14-Q00, LXK2-PR14-R00 LXK2-PD12-Q00, LXK2-PD12-R00, LXK2-PD12-S00 LXK2-PH12-R00, LXK2-PH12-S00 LXK2-PL12-P00, LXK2-PL12-Q00, LXK2-PL12-R00 Source: www.luxeon.com KINGBRIGHT: KA-3528ASYC Source: www.kingbright.com
FT-60 FUEL MANIFOLD OIL = EAA:PRESSURE_SENSOR
GAD29 = EAA:GAD29; _EXTERNAL_: _EXTERNAL_
GDL51R = EAA:GDL51; _EXTERNAL_: _EXTERNAL_
GEA24 = EAA:GEA24; _EXTERNAL_: _EXTERNAL_
GMA-245 = EAA:GMA-245; _EXTERNAL_: _EXTERNAL_
GSU25_BACKUP GSU25_PRIMARY = EAA:GSU25; _EXTERNAL_: _EXTERNAL_
GTN650 = EAA:GTN_650; _EXTERNAL_: _EXTERNAL_
GTP59 = EAA:GTP59; _EXTERNAL_: _EXTERNAL_
GTR-20 = EAA:GTR20; _EXTERNAL_: _EXTERNAL_
GTX45R = EAA:GTX45R
LED1 = led:TLLR4400: Low Current (2mA) LED 3 mm Tinted Diffused Package color RED Source: Data sheet <http://www.farnell.com/datasheets/391100.pdf>; MF: VISHAY SEMICONDUCTOR; OC_FARNELL: 1612437
MASTER_CONTACTOR MASTER_CONTACTOR1 MASTER_CONTACTOR2 = EAA:MASTER_CONTACTOR; _EXTERNAL_: _EXTERNAL_
MFD PFD = EAA:GDU_45X; _EXTERNAL_: _EXTERNAL_
OIL_SWITCH = EAA:PRESSURE_SWITCH
PITCH ROLL YAW = EAA:GSA28; _EXTERNAL_: _EXTERNAL_
PITCH_TRIM ROLL_TRIM = EAA:RAYALLEN_T2; _EXTERNAL_: _EXTERNAL_
PITOT_HEAT = EAA:GAP26; _EXTERNAL_: _EXTERNAL_
POSI-STROBE = EAA:POSISTROBE; _EXTERNAL_: _EXTERNAL_
REVERSIONARY = switch:55?: PUSHBUTTON SERIES 5500 SWITCHES Source: www.e-switch.com .. 5500.pdf
STARTER_SWITCH = EAA:ACS_A510_2
SYSTEM_32_1 SYSTEM_32_2 = EAA:SYSTEM_32; _EXTERNAL_: _EXTERNAL_
U$1 = EAA:VPX_PRO; _EXTERNAL_: _EXTERNAL_
U$2 = EAA:STARTER_CONTACTOR; _EXTERNAL_: _EXTERNAL_
U$3 = EAA:HOBBS_METER
U$4 = EAA:G3X_CONFIG; _EXTERNAL_: _EXTERNAL_
U$5 = EAA:CPC_28; _EXTERNAL_: _EXTERNAL_
U$6 = EAA:BULKHEAD; _EXTERNAL_: _EXTERNAL_
U$7 = EAA:ACK_E04; _EXTERNAL_: _EXTERNAL_
U$8 = EAA:THERMOCOUPLE
U$10 = EAA:SHUNT; _EXTERNAL_: _EXTERNAL_
U$11 = EAA:GMU22; _EXTERNAL_: _EXTERNAL_
U$12 = EAA:FORREST_OF_TABS
U$13 = EAA:CPC_15; _EXTERNAL_: _EXTERNAL_
U$14 = EAA:GMC507; _EXTERNAL_: _EXTERNAL_
USB_CHGR = EAA:WM16793-ND; _EXTERNAL_: _EXTERNAL_